# Altium project EL2086.PrjPcb (part 1 of 3)
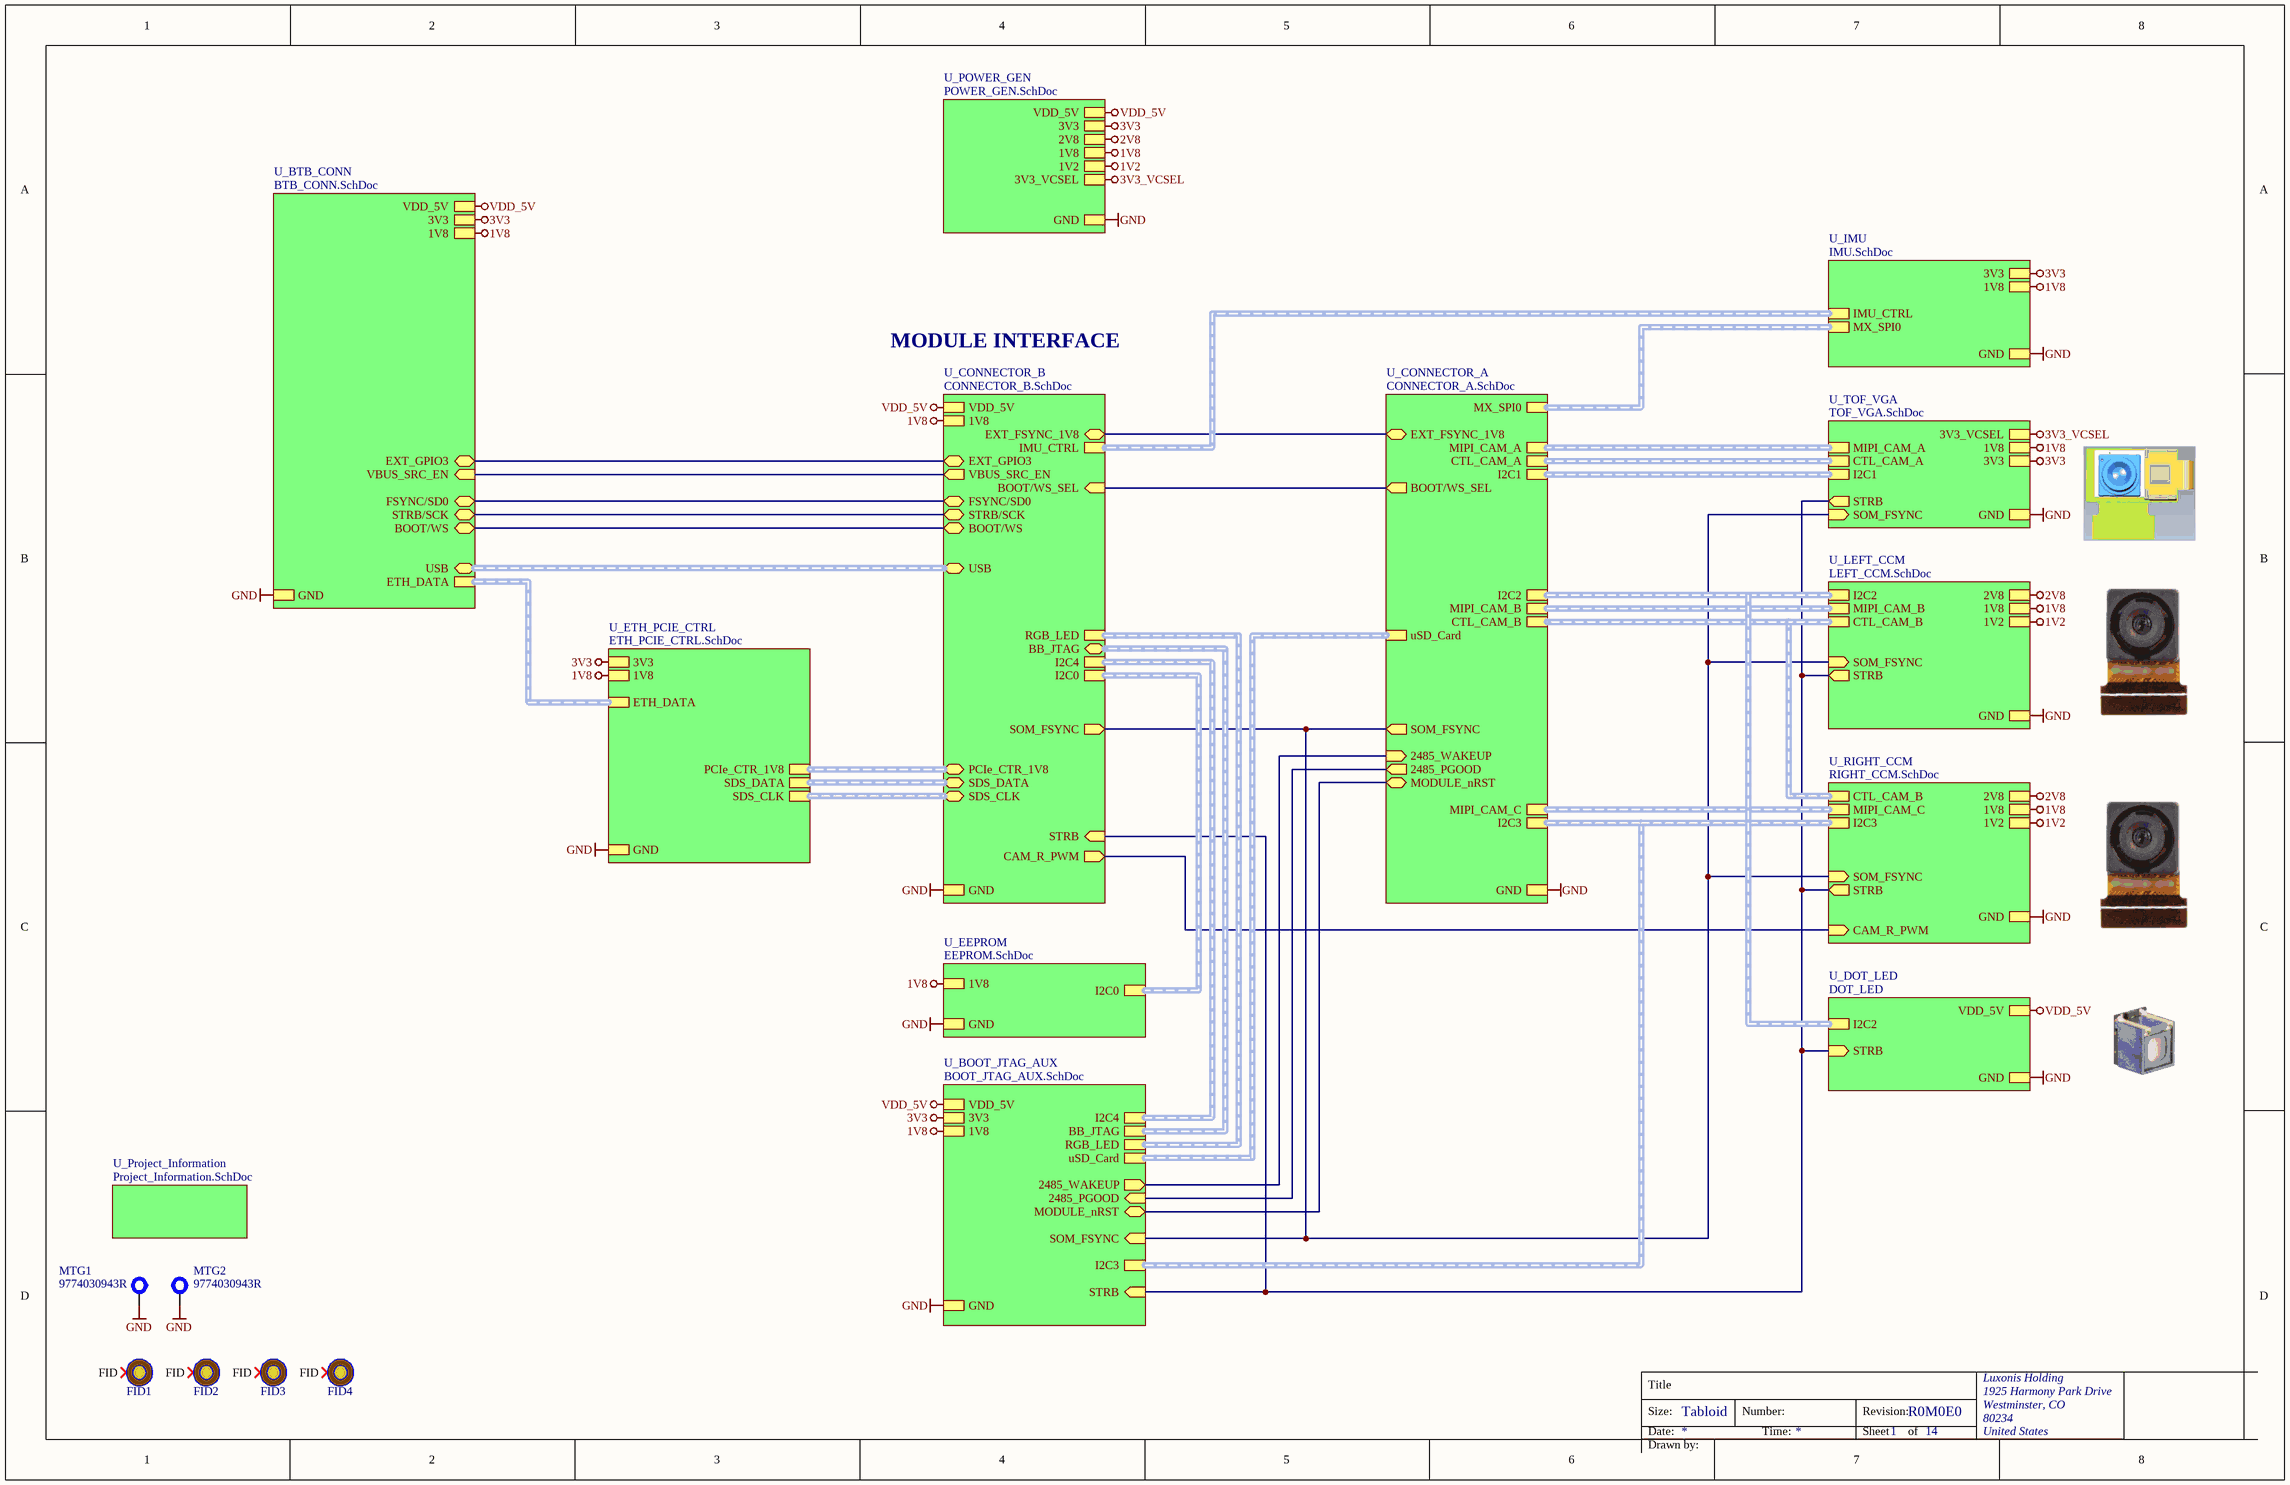
[diagram p0: TopLevel.SchDoc]
document_number: D2088000; drawn_by: Eason Lin; project_title: EL2086; revision: R0M0E0
14 sheets, 259 parts. Net scope: strictly hierarchical (ports join the sheet entries above them; power ports are local).
Board file: EL2086.PcbDoc
Sheets:
  TopLevel.SchDoc
    U_Project_Information = Project_Information.SchDoc
    U_CONNECTOR_B = CONNECTOR_B.SchDoc
    U_CONNECTOR_A = CONNECTOR_A.SchDoc
    U_ETH_PCIE_CTRL = ETH_PCIE_CTRL.SchDoc
    U_BOOT_JTAG_AUX = BOOT_JTAG_AUX.SchDoc
    U_POWER_GEN = POWER_GEN.SchDoc
    U_TOF_VGA = TOF_VGA.SchDoc
    U_RIGHT_CCM = RIGHT_CCM.SchDoc
    U_LEFT_CCM = LEFT_CCM.SchDoc
    U_IMU = IMU.SchDoc
    U_EEPROM = EEPROM.SchDoc
    U_DOT_LED = DOT_LED.SchDoc
    U_BTB_CONN = BTB_CONN.SchDoc

## Sheet TopLevel.SchDoc: =project_title
size Tabloid; CompanyName: Luxonis Holding; DrawnBy: Eason Lin; Organization: Luxonis Holding; Address1: 1925 Harmony Park Drive; Address2: Westminster, CO; Address3: 80234; Address4: United States; DocumentNumber: D2088000; Revision: R0M0E0; SheetNumber: 1; SheetTotal: 14

### Parts
FID1  FIDUCIAL_ROUND_1MM  [FIDUCIAL_ROUND_1MM]  (value not drawn)  (no BOM)
FID2  FIDUCIAL_ROUND_1MM  [FIDUCIAL_ROUND_1MM]  (value not drawn)  (no BOM)
FID3  FIDUCIAL_ROUND_1MM  [FIDUCIAL_ROUND_1MM]  (value not drawn)  (no BOM)
FID4  FIDUCIAL_ROUND_1MM  [FIDUCIAL_ROUND_1MM]  (value not drawn)  (no BOM)
MTG1  9774030943R  [9774030943R]
MTG2  9774030943R  [9774030943R]

### Sub-sheets
U_BOOT_JTAG_AUX = BOOT_JTAG_AUX.SchDoc: RGB_LED (harness RGB_LED), BB_JTAG (harness BB_JTAG), uSD_Card (harness uSD_Card), 2485_WAKEUP (out), I2C3 (harness I2C3), 2485_PGOOD (in), 1V8, 3V3, VDD_5V, STRB (in), SOM_FSYNC (in), I2C4 (harness I2C4), GND, MODULE_nRST (bidir)
U_BTB_CONN = BTB_CONN.SchDoc: VBUS_SRC_EN (in), GND, ETH_DATA (harness ETH_DATA), VDD_5V, 3V3, 1V8, USB (bidir, harness USB), EXT_GPIO3 (bidir), FSYNC/SD0 (bidir), STRB/SCK (bidir), BOOT/WS (bidir)
U_CONNECTOR_A = CONNECTOR_A.SchDoc: uSD_Card (harness uSD_Card), MIPI_CAM_C (harness MIPI_CAM_C), CTL_CAM_A (harness CTL_CAM_A), MIPI_CAM_A (harness MIPI_CAM_A), MIPI_CAM_B (harness MIPI_CAM_B), GND, I2C3 (harness I2C3), CTL_CAM_B (harness CTL_CAM_B), SOM_FSYNC (out), 2485_WAKEUP (in), 2485_PGOOD (out), MX_SPI0 (harness MX_SPI0), I2C1 (harness I2C1), I2C2 (harness I2C2), EXT_FSYNC_1V8 (bidir), MODULE_nRST (bidir), BOOT/WS_SEL (out)
U_CONNECTOR_B = CONNECTOR_B.SchDoc: I2C0 (harness I2C0), VDD_5V, PCIe_CTR_1V8 (bidir, harness PCIe_CTR_1V8), BB_JTAG (bidir, harness BB_JTAG), SDS_DATA (bidir, harness SDS_DATA), SDS_CLK (bidir, harness SDS_CLK), IMU_CTRL (harness IMU_CTRL), RGB_LED (harness RGB_LED), 1V8, CAM_R_PWM (out), SOM_FSYNC (out), I2C4 (harness I2C4), GND, USB (bidir, harness USB), VBUS_SRC_EN (out), EXT_GPIO3 (bidir), BOOT/WS (bidir), STRB/SCK (bidir), FSYNC/SD0 (bidir), BOOT/WS_SEL (in), EXT_FSYNC_1V8 (bidir), STRB (in)
U_DOT_LED = DOT_LED: VDD_5V, GND, I2C2 (harness I2C2), STRB (in)
U_EEPROM = EEPROM.SchDoc: 1V8, I2C0 (harness I2C0), GND
U_ETH_PCIE_CTRL = ETH_PCIE_CTRL.SchDoc: ETH_DATA (harness ETH_DATA), SDS_DATA (harness SDS_DATA), 3V3, SDS_CLK (harness SDS_CLK), 1V8, PCIe_CTR_1V8 (harness PCIe_CTR_1V8), GND
U_IMU = IMU.SchDoc: 3V3, 1V8, MX_SPI0 (harness MX_SPI0), IMU_CTRL (harness IMU_CTRL), GND
U_LEFT_CCM = LEFT_CCM.SchDoc: I2C2 (harness I2C2), CTL_CAM_B (harness CTL_CAM_B), MIPI_CAM_B (harness MIPI_CAM_B), 1V2, 2V8, 1V8, SOM_FSYNC (in), STRB (out), GND
U_POWER_GEN = POWER_GEN.SchDoc: GND, 3V3, 1V8, 1V2, 2V8, VDD_5V, 3V3_VCSEL
U_Project_Information = Project_Information.SchDoc: no entries
U_RIGHT_CCM = RIGHT_CCM.SchDoc: MIPI_CAM_C (harness MIPI_CAM_C), I2C3 (harness I2C3), 1V2, 2V8, 1V8, CTL_CAM_B (harness CTL_CAM_B), CAM_R_PWM (in), SOM_FSYNC (in), GND, STRB (out)
U_TOF_VGA = TOF_VGA.SchDoc: 3V3_VCSEL, 1V8, GND, I2C1 (harness I2C1), CTL_CAM_A (harness CTL_CAM_A), MIPI_CAM_A (harness MIPI_CAM_A), SOM_FSYNC (in), 3V3, STRB (out)

### Nets
1V2: sheet U_POWER_GEN/1V2, sheet U_RIGHT_CCM/1V2, sheet U_LEFT_CCM/1V2
1V8: sheet U_CONNECTOR_B/1V8, sheet U_ETH_PCIE_CTRL/1V8, sheet U_BOOT_JTAG_AUX/1V8, sheet U_POWER_GEN/1V8, sheet U_TOF_VGA/1V8, sheet U_RIGHT_CCM/1V8, sheet U_LEFT_CCM/1V8, sheet U_IMU/1V8, sheet U_EEPROM/1V8, sheet U_BTB_CONN/1V8
2V8: sheet U_POWER_GEN/2V8, sheet U_RIGHT_CCM/2V8, sheet U_LEFT_CCM/2V8
3V3: sheet U_ETH_PCIE_CTRL/3V3, sheet U_BOOT_JTAG_AUX/3V3, sheet U_POWER_GEN/3V3, sheet U_TOF_VGA/3V3, sheet U_IMU/3V3, sheet U_BTB_CONN/3V3
3V3_VCSEL: sheet U_POWER_GEN/3V3_VCSEL, sheet U_TOF_VGA/3V3_VCSEL
GND: MTG1.1 MTG2.1 ; sheet U_CONNECTOR_B/GND, sheet U_CONNECTOR_A/GND, sheet U_ETH_PCIE_CTRL/GND, sheet U_BOOT_JTAG_AUX/GND, sheet U_POWER_GEN/GND, sheet U_TOF_VGA/GND, sheet U_RIGHT_CCM/GND, sheet U_LEFT_CCM/GND, sheet U_IMU/GND, sheet U_EEPROM/GND, sheet U_DOT_LED/GND, sheet U_BTB_CONN/GND
VDD_5V: sheet U_CONNECTOR_B/VDD_5V, sheet U_BOOT_JTAG_AUX/VDD_5V, sheet U_POWER_GEN/VDD_5V, sheet U_DOT_LED/VDD_5V, sheet U_BTB_CONN/VDD_5V
2485_PGOOD: sheet U_CONNECTOR_A/2485_PGOOD, sheet U_BOOT_JTAG_AUX/2485_PGOOD
2485_WAKEUP: sheet U_CONNECTOR_A/2485_WAKEUP, sheet U_BOOT_JTAG_AUX/2485_WAKEUP
BOOT/WS: sheet U_CONNECTOR_B/BOOT/WS, sheet U_BTB_CONN/BOOT/WS
BOOT/WS_SEL: sheet U_CONNECTOR_B/BOOT/WS_SEL, sheet U_CONNECTOR_A/BOOT/WS_SEL
CAM_R_PWM: sheet U_CONNECTOR_B/CAM_R_PWM, sheet U_RIGHT_CCM/CAM_R_PWM
EXT_FSYNC_1V8: sheet U_CONNECTOR_B/EXT_FSYNC_1V8, sheet U_CONNECTOR_A/EXT_FSYNC_1V8
FSYNC/SD0: sheet U_CONNECTOR_B/FSYNC/SD0, sheet U_BTB_CONN/FSYNC/SD0
IO50/I2S2_IN_SD0: sheet U_CONNECTOR_B/EXT_GPIO3, sheet U_BTB_CONN/EXT_GPIO3
MODULE_nRST: sheet U_CONNECTOR_A/MODULE_nRST, sheet U_BOOT_JTAG_AUX/MODULE_nRST
SOM_FSYNC: sheet U_CONNECTOR_B/SOM_FSYNC, sheet U_CONNECTOR_A/SOM_FSYNC, sheet U_BOOT_JTAG_AUX/SOM_FSYNC, sheet U_TOF_VGA/SOM_FSYNC, sheet U_RIGHT_CCM/SOM_FSYNC, sheet U_LEFT_CCM/SOM_FSYNC
STRB: sheet U_CONNECTOR_B/STRB, sheet U_BOOT_JTAG_AUX/STRB, sheet U_TOF_VGA/STRB, sheet U_RIGHT_CCM/STRB, sheet U_LEFT_CCM/STRB, sheet U_DOT_LED/STRB
STRB/SCK: sheet U_CONNECTOR_B/STRB/SCK, sheet U_BTB_CONN/STRB/SCK
NetJ7_28: sheet U_CONNECTOR_B/VBUS_SRC_EN, sheet U_BTB_CONN/VBUS_SRC_EN

Not connected (* = marked no-connect by the designer): FID1 FID*; FID2 FID*; FID3 FID*; FID4 FID*

### Buses and harness runs
harness sheet U_BOOT_JTAG_AUX/BB_JTAG = sheet U_CONNECTOR_B/BB_JTAG
harness sheet U_BOOT_JTAG_AUX/I2C3 = sheet U_CONNECTOR_A/I2C3 = sheet U_RIGHT_CCM/I2C3
harness sheet U_BOOT_JTAG_AUX/I2C4 = sheet U_CONNECTOR_B/I2C4
harness sheet U_BOOT_JTAG_AUX/RGB_LED = sheet U_CONNECTOR_B/RGB_LED
harness sheet U_BOOT_JTAG_AUX/uSD_Card = sheet U_CONNECTOR_A/uSD_Card
harness sheet U_BTB_CONN/ETH_DATA = sheet U_ETH_PCIE_CTRL/ETH_DATA
harness sheet U_BTB_CONN/USB = sheet U_CONNECTOR_B/USB
harness sheet U_CONNECTOR_A/CTL_CAM_A = sheet U_TOF_VGA/CTL_CAM_A
harness sheet U_CONNECTOR_A/CTL_CAM_B = sheet U_LEFT_CCM/CTL_CAM_B = sheet U_RIGHT_CCM/CTL_CAM_B
harness sheet U_CONNECTOR_A/I2C1 = sheet U_TOF_VGA/I2C1
harness sheet U_CONNECTOR_A/I2C2 = sheet U_DOT_LED/I2C2 = sheet U_LEFT_CCM/I2C2
harness sheet U_CONNECTOR_A/MIPI_CAM_A = sheet U_TOF_VGA/MIPI_CAM_A
harness sheet U_CONNECTOR_A/MIPI_CAM_B = sheet U_LEFT_CCM/MIPI_CAM_B
harness sheet U_CONNECTOR_A/MIPI_CAM_C = sheet U_RIGHT_CCM/MIPI_CAM_C
harness sheet U_CONNECTOR_A/MX_SPI0 = sheet U_IMU/MX_SPI0
harness sheet U_CONNECTOR_B/I2C0 = sheet U_EEPROM/I2C0
harness sheet U_CONNECTOR_B/IMU_CTRL = sheet U_IMU/IMU_CTRL
harness sheet U_CONNECTOR_B/PCIe_CTR_1V8 = sheet U_ETH_PCIE_CTRL/PCIe_CTR_1V8
harness sheet U_CONNECTOR_B/SDS_CLK = sheet U_ETH_PCIE_CTRL/SDS_CLK
harness sheet U_CONNECTOR_B/SDS_DATA = sheet U_ETH_PCIE_CTRL/SDS_DATA

### Notes on the sheet
- MODULE INTERFACE
- Title
- Size:
- Date:
- Tabloid
- Number:
- Time:
- Revision:
- Sheet
- of
- Drawn by:

### Library data of the parts
FID1-FID4 = FIDUCIAL: Fiducial with various available footprints
MTG1 MTG2 = CMP-090-000000-4: Spacers/Standoffs; Manufacturer 1: Wurth Electronics; Manufacturer Part Number 1: 9774030943R

## Sheet Project_Information.SchDoc: =project_title
size Tabloid; CompanyName: Luxonis Holding; DrawnBy: Eason Lin; Organization: Luxonis Holding; Address1: 1925 Harmony Park Drive; Address2: Westminster, CO; Address3: 80234; Address4: United States; DocumentNumber: D2088000; Revision: R0M0E0; SheetNumber: 2; SheetTotal: 14
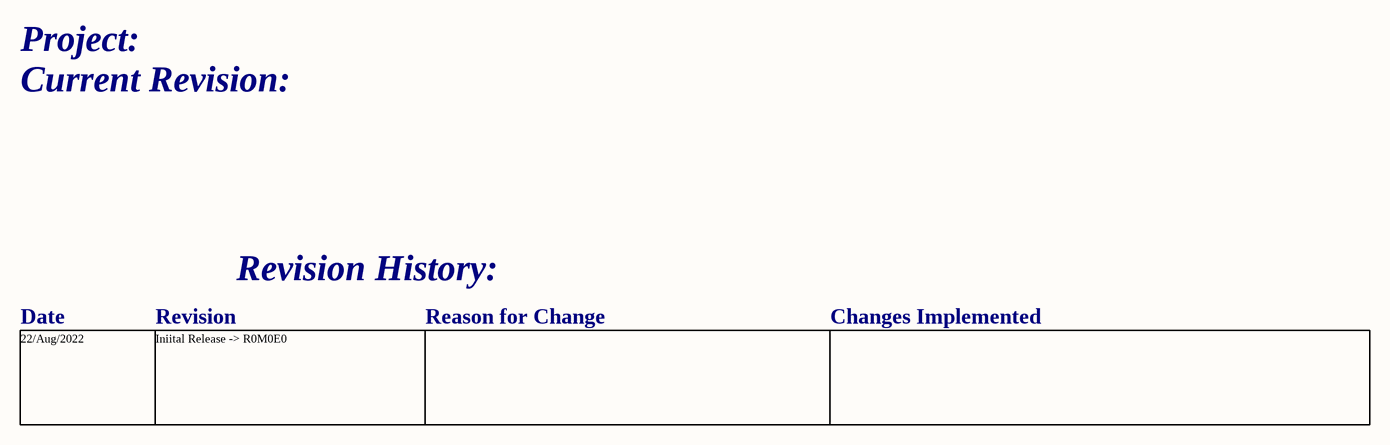
[diagram p1: Project_Information.SchDoc]

### Notes on the sheet
- Project:
- Current Revision:
- Revision History:
- Date
- Revision
- Reason for Change
- Changes Implemented
- 22/Aug/2022
- Iniital Release -> R0M0E0
- Title
- Size:
- Date:
- Tabloid
- Number:
- Time:
- Revision:
- Sheet
- of
- Drawn by:

## Sheet CONNECTOR_B.SchDoc: =project_title
size Tabloid; CompanyName: Luxonis Holding; DrawnBy: Eason Lin; Organization: Luxonis Holding; Address1: 1925 Harmony Park Drive; Address2: Westminster, CO; Address3: 80234; Address4: United States; DocumentNumber: D2088000; Revision: R0M0E0; SheetNumber: 6; SheetTotal: 14
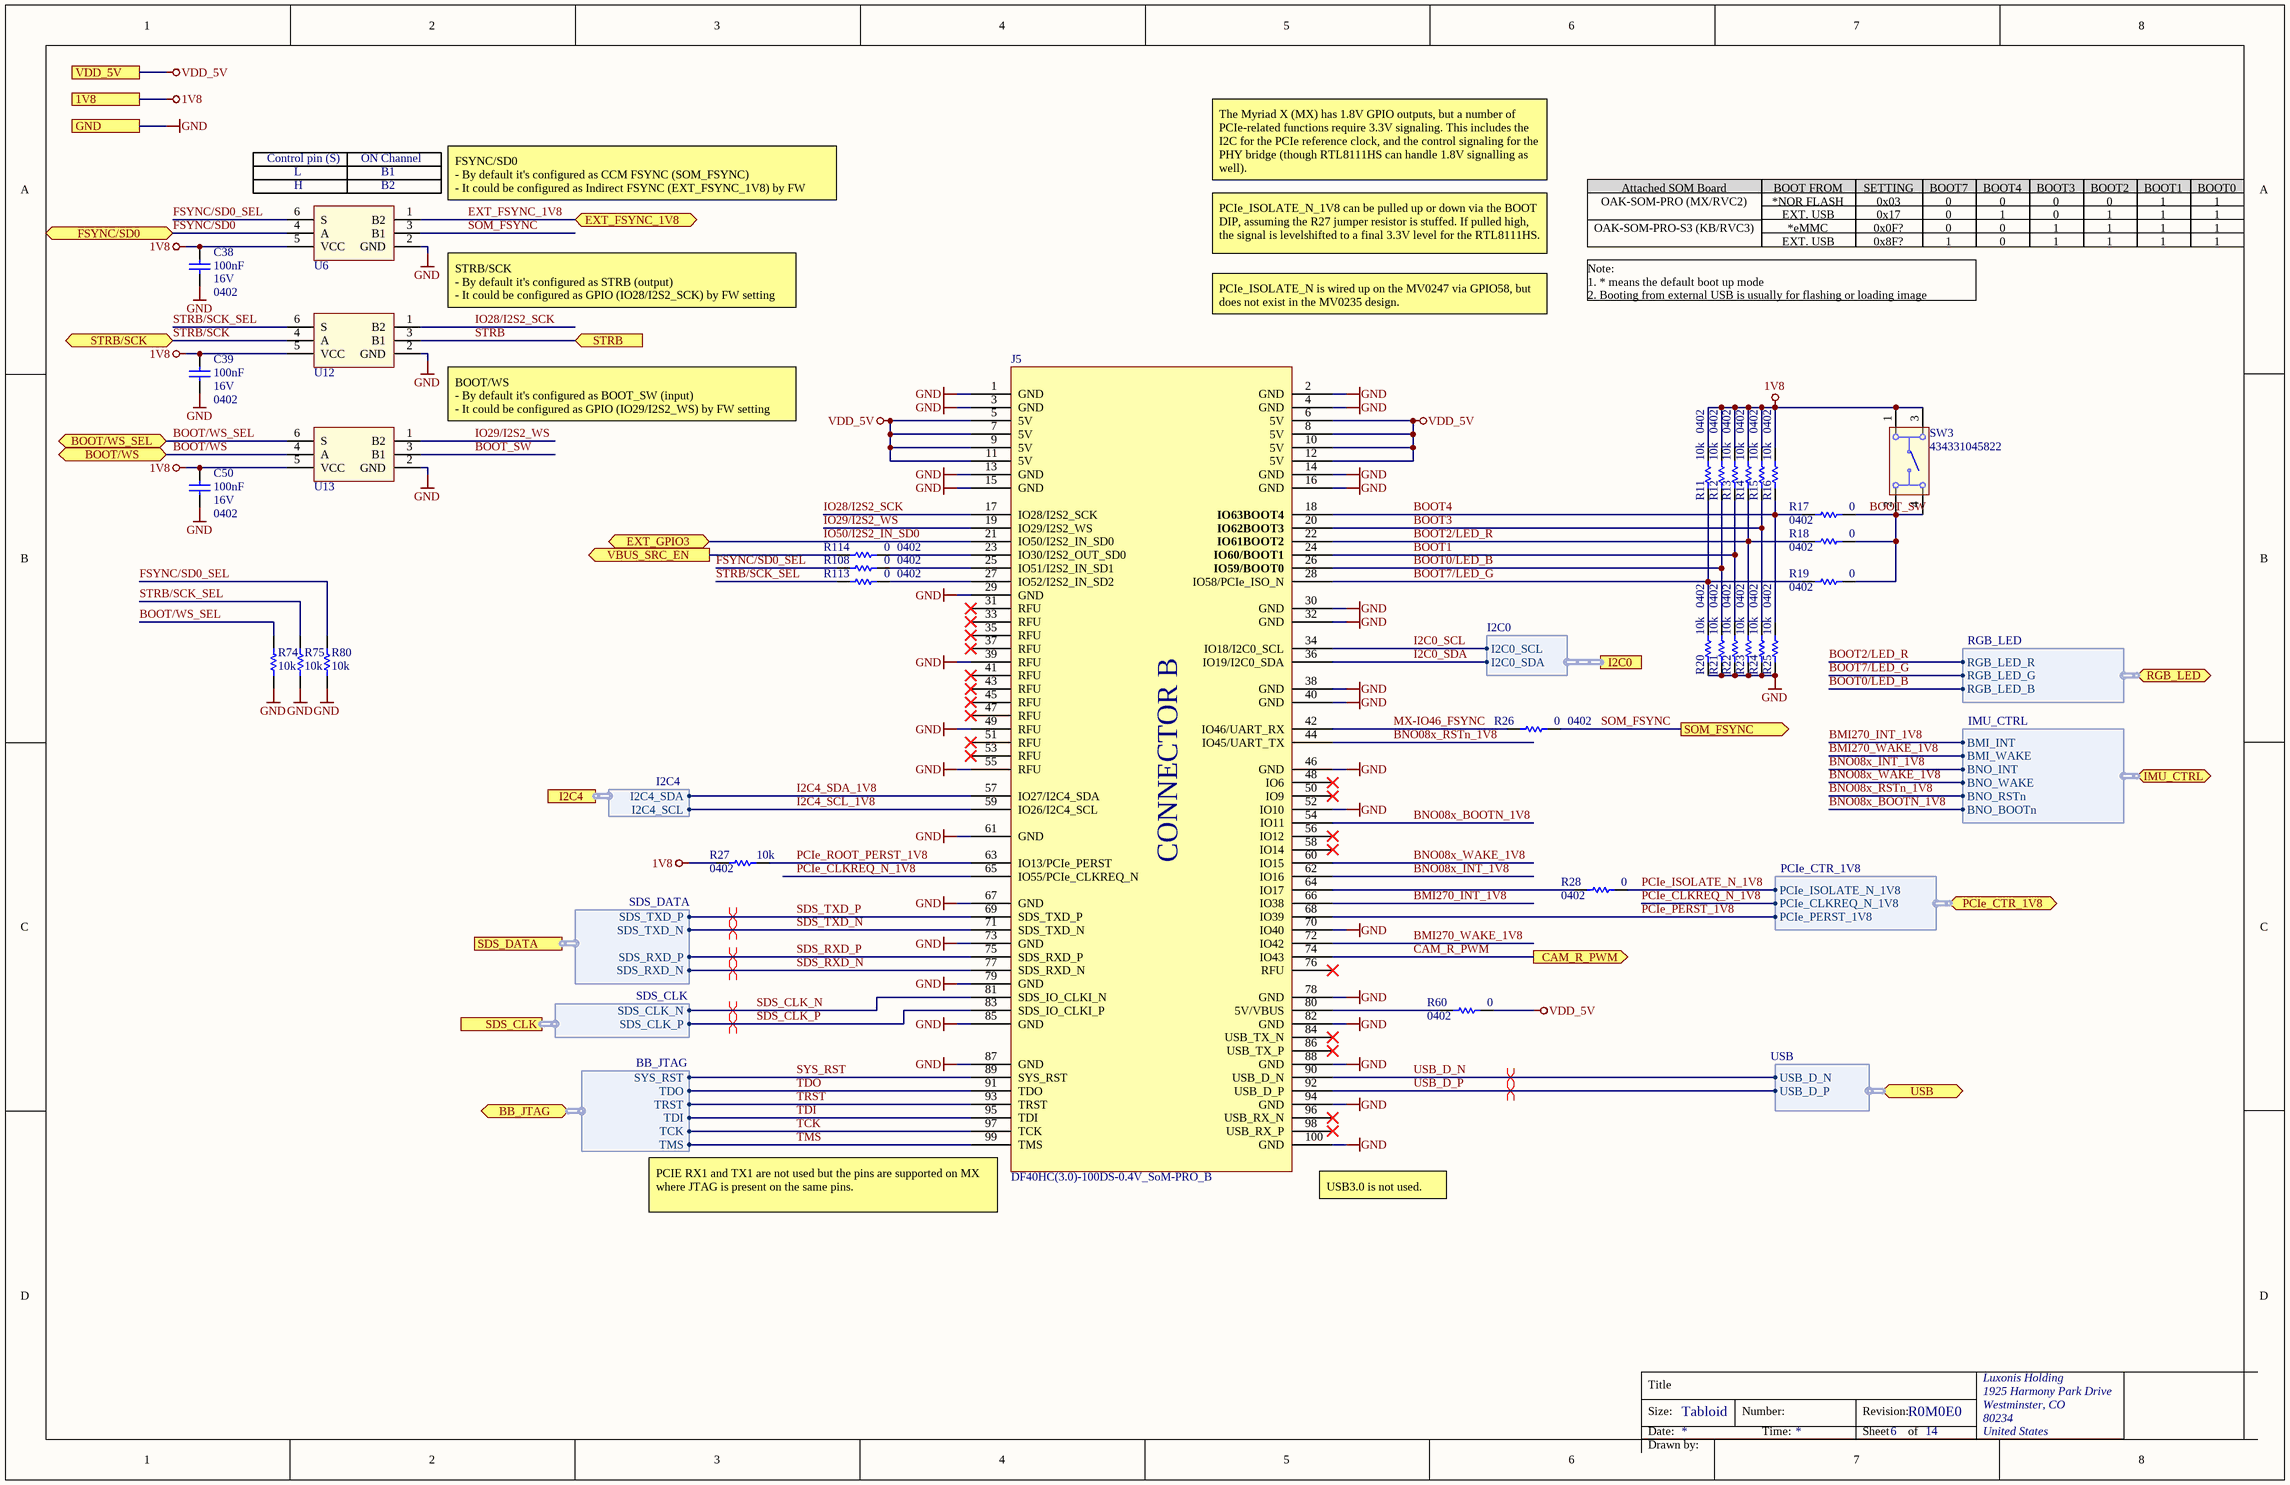
[diagram p2: CONNECTOR_B.SchDoc]

### Parts
C38  value 100nF  Voltage Rating: 16V  Case/Package: 0402  [CAPC0402(1005)60_N]  (hidden comment: CL05B104KO5NFNC)
C39  value 100nF  Voltage Rating: 16V  Case/Package: 0402  [CAPC0402(1005)60_N]  (hidden comment: CL05B104KO5NFNC)
C50  value 100nF  Voltage Rating: 16V  Case/Package: 0402  [CAPC0402(1005)60_N]  (hidden comment: CL05B104KO5NFNC)
J5  DF40HC(3.0)-100DS-0.4V_SoM-PRO_B  [CON_B_BW2099_SoM_DF40HC-3.0-100DS-0.4V_minpad]
R11  value 10k  Case/Package: 0402  [RESC0402(1005)_N]  (hidden comment: RC0402FR-1310KL)
R12  value 10k  Case/Package: 0402  [RESC0402(1005)_N]  (hidden comment: RC0402FR-1310KL)
R13  value 10k  Case/Package: 0402  [RESC0402(1005)_N]  (hidden comment: RC0402FR-1310KL)
R14  value 10k  Case/Package: 0402  [RESC0402(1005)_N]  (hidden comment: RC0402FR-1310KL)
R15  value 10k  Case/Package: 0402  [RESC0402(1005)_N]  (hidden comment: RC0402FR-1310KL)
R16  value 10k  Case/Package: 0402  [RESC0402(1005)_N]  (hidden comment: RC0402FR-1310KL)
R17  value 0  Case/Package: 0402  [RESC0402(1005)_L]  (hidden comment: CRCW04020000Z0ED)
R18  value 0  Case/Package: 0402  [RESC0402(1005)_L]  (hidden comment: CRCW04020000Z0ED)
R19  value 0  Case/Package: 0402  [RESC0402(1005)_L]  (hidden comment: CRCW04020000Z0ED)
R20  value 10k  Case/Package: 0402  [RESC0402(1005)_N]  (hidden comment: RC0402FR-1310KL)
R21  value 10k  Case/Package: 0402  [RESC0402(1005)_N]  (hidden comment: RC0402FR-1310KL)
R22  value 10k  Case/Package: 0402  [RESC0402(1005)_N]  (hidden comment: RC0402FR-1310KL)
R23  value 10k  Case/Package: 0402  [RESC0402(1005)_N]  (hidden comment: RC0402FR-1310KL)
R24  value 10k  Case/Package: 0402  [RESC0402(1005)_N]  (hidden comment: RC0402FR-1310KL)
R25  value 10k  Case/Package: 0402  [RESC0402(1005)_N]  (hidden comment: RC0402FR-1310KL)
R26  value 0  Case/Package: 0402  [RESC0402(1005)_L]  (hidden comment: CRCW04020000Z0ED)
R27  value 10k  Case/Package: 0402  [RESC0402(1005)_N]  (hidden comment: RC0402FR-1310KL)
R28  value 0  Case/Package: 0402  [RESC0402(1005)_L]  (hidden comment: CRCW04020000Z0ED)
R60  value 0  Case/Package: 0402  [RESC0402(1005)_L]  (hidden comment: CRCW04020000Z0ED)
R74  value 10k  [RESC0402(1005)_N]  (hidden comment: RC0402FR-1310KL)
R75  value 10k  [RESC0402(1005)_N]  (hidden comment: RC0402FR-1310KL)
R80  value 10k  [RESC0402(1005)_N]  (hidden comment: RC0402FR-1310KL)
R108  value 0  Case/Package: 0402  [RESC0402(1005)_L]  (hidden comment: CRCW04020000Z0ED)
R113  value 0  Case/Package: 0402  [RESC0402(1005)_L]  (hidden comment: CRCW04020000Z0ED)
R114  value 0  Case/Package: 0402  [RESC0402(1005)_L]  (hidden comment: CRCW04020000Z0ED)
SW3  434331045822  [434331045822]
U6  SN74LVC1G3157DCKR  [DCK6_65]  (value not drawn)
U12  SN74LVC1G3157DCKR  [DCK6_65]  (value not drawn)
U13  SN74LVC1G3157DCKR  [DCK6_65]  (value not drawn)

### Ports
1V8, BB_JTAG (bidir, harness BB_JTAG), BOOT/WS (bidir), BOOT/WS_SEL (bidir), CAM_R_PWM (out), EXT_FSYNC_1V8 (bidir), EXT_GPIO3 (bidir), FSYNC/SD0 (bidir), GND, I2C0 (harness I2C0), I2C4 (harness I2C4), IMU_CTRL (bidir, harness IMU_CTRL), PCIe_CTR_1V8 (bidir, harness PCIe_CTR_1V8), RGB_LED (bidir, harness RGB_LED), SDS_CLK (harness SDS_CLK), SDS_DATA (harness SDS_DATA), SOM_FSYNC (out), STRB (in), STRB/SCK (bidir), USB (bidir, harness USB), VBUS_SRC_EN (out), VDD_5V

### Harnesses
USB: USB_D_P, USB_D_N
I2C0: I2C0_SDA, I2C0_SCL
BB_JTAG: SYS_RST, TDO, TRST, TDI, TCK, TMS
SDS_DATA: SDS_TXD_P, SDS_TXD_N, SDS_RXD_P, SDS_RXD_N
PCIe_CTR_1V8: PCIe_CLKREQ_N_1V8, PCIe_ISOLATE_N_1V8, PCIe_PERST_1V8
SDS_CLK: SDS_CLK_P, SDS_CLK_N
RGB_LED: RGB_LED_G, RGB_LED_B, RGB_LED_R
IMU_CTRL: BMI_INT, BMI_WAKE, BNO_INT, BNO_WAKE, BNO_RSTn, BNO_BOOTn
I2C4: I2C4_SDA, I2C4_SCL

### Nets
1V8: C38.2 C39.2 C50.2 R11.2 R12.2 R13.2 R14.2 R15.2 R16.2 R27.2 SW3.1 SW3.3 U6.5(VCC) U12.5(VCC) U13.5(VCC) ; port 1V8
GND: C38.1 C39.1 C50.1 J5.1(GND) J5.2(GND) J5.3(GND) J5.4(GND) J5.13(GND) J5.14(GND) J5.15(GND) J5.16(GND) J5.29(GND) J5.30(GND) J5.32(GND) J5.38(GND) J5.39(RFU) J5.40(GND) J5.46(GND) J5.49(RFU) J5.52(IO10) J5.55(RFU) J5.61(GND) J5.67(GND) J5.70(IO40) J5.73(GND) J5.78(GND) J5.79(GND) J5.82(GND) J5.85(GND) J5.87(GND) J5.88(GND) J5.94(GND) J5.100(GND) R20.1 R21.1 R22.1 R23.1 R24.1 R25.1 R74.1 R75.1 R80.1 U6.2(GND) U12.2(GND) U13.2(GND) ; port GND
VDD_5V: J5.5(5V) J5.6(5V) J5.7(5V) J5.8(5V) J5.9(5V) J5.10(5V) J5.11(5V) J5.12(5V) R60.2 ; port VDD_5V
BMI270_INT_1V8: J5.66(IO38) ; port IMU_CTRL.BMI_INT
BMI270_WAKE_1V8: J5.72(IO42) ; port IMU_CTRL.BMI_WAKE
BNO08x_BOOTN_1V8: J5.54(IO11) ; port IMU_CTRL.BNO_BOOTn
BNO08x_INT_1V8: J5.62(IO16) ; port IMU_CTRL.BNO_INT
BNO08x_RSTn_1V8: J5.44(IO45/UART_TX) ; port IMU_CTRL.BNO_RSTn
BNO08x_WAKE_1V8: J5.60(IO15) ; port IMU_CTRL.BNO_WAKE
BOOT0/LED_B: J5.26(IO59/BOOT0) R12.1 R21.2 ; port RGB_LED.RGB_LED_B
BOOT1: J5.24(IO60/BOOT1) R13.1 R22.2
BOOT2/LED_R: J5.22(IO61BOOT2) R14.1 R18.1 R23.2 ; port RGB_LED.RGB_LED_R
BOOT3: J5.20(IO62BOOT3) R15.1 R24.2
BOOT4: J5.18(IO63BOOT4) R16.1 R17.1 R25.2
BOOT7/LED_G: J5.28(IO58/PCIe_ISO_N) R11.1 R19.1 R20.2 ; port RGB_LED.RGB_LED_G
BOOT/WS: U13.4(A) ; port BOOT/WS
BOOT/WS_SEL: R74.2 U13.6(S) ; port BOOT/WS_SEL
BOOT_SW: R17.2 R18.2 R19.2 SW3.2 SW3.4 U13.3(B1)
CAM_R_PWM: J5.74(IO43) ; port CAM_R_PWM
EXT_FSYNC_1V8: U6.1(B2) ; port EXT_FSYNC_1V8
FSYNC/SD0: U6.4(A) ; port FSYNC/SD0
FSYNC/SD0_SEL: R80.2 R108.1 U6.6(S)
I2C0_SCL: J5.34(IO18/I2C0_SCL) ; port I2C0.I2C0_SCL
I2C0_SDA: J5.36(IO19/I2C0_SDA) ; port I2C0.I2C0_SDA
I2C4_SCL_1V8: J5.59(IO26/I2C4_SCL) ; port I2C4.I2C4_SCL
I2C4_SDA_1V8: J5.57(IO27/I2C4_SDA) ; port I2C4.I2C4_SDA
IO28/I2S2_SCK: J5.17(IO28/I2S2_SCK) U12.1(B2)
IO29/I2S2_WS: J5.19(IO29/I2S2_WS) U13.1(B2)
IO50/I2S2_IN_SD0: J5.21(IO50/I2S2_IN_SD0) ; port EXT_GPIO3
MX-IO46_FSYNC: J5.42(IO46/UART_RX) R26.1
PCIe_CLKREQ_N_1V8: J5.65(IO55/PCIe_CLKREQ_N) ; port PCIe_CTR_1V8.PCIe_CLKREQ_N_1V8
PCIe_ISOLATE_N_1V8: R28.2 ; port PCIe_CTR_1V8.PCIe_ISOLATE_N_1V8
PCIe_PERST_1V8: J5.68(IO39) ; port PCIe_CTR_1V8.PCIe_PERST_1V8
PCIe_ROOT_PERST_1V8: J5.63(IO13/PCIe_PERST) R27.1
SDS_CLK_N: J5.81(SDS_IO_CLKI_N) ; port SDS_CLK.SDS_CLK_N
SDS_CLK_P: J5.83(SDS_IO_CLKI_P) ; port SDS_CLK.SDS_CLK_P
SDS_RXD_N: J5.77(SDS_RXD_N) ; port SDS_DATA.SDS_RXD_N
SDS_RXD_P: J5.75(SDS_RXD_P) ; port SDS_DATA.SDS_RXD_P
SDS_TXD_N: J5.71(SDS_TXD_N) ; port SDS_DATA.SDS_TXD_N
SDS_TXD_P: J5.69(SDS_TXD_P) ; port SDS_DATA.SDS_TXD_P
SOM_FSYNC: R26.2 U6.3(B1) ; port SOM_FSYNC
STRB: U12.3(B1) ; port STRB
STRB/SCK: U12.4(A) ; port STRB/SCK
STRB/SCK_SEL: R75.2 R113.1 U12.6(S)
SYS_RST: J5.89(SYS_RST) ; port BB_JTAG.SYS_RST
TCK: J5.97(TCK) ; port BB_JTAG.TCK
TDI: J5.95(TDI) ; port BB_JTAG.TDI
TDO: J5.91(TDO) ; port BB_JTAG.TDO
TMS: J5.99(TMS) ; port BB_JTAG.TMS
TRST: J5.93(TRST) ; port BB_JTAG.TRST
USB_D_N: J5.90(USB_D_N) ; port USB.USB_D_N
USB_D_P: J5.92(USB_D_P) ; port USB.USB_D_P
NetJ5_23: J5.23(IO30/I2S2_OUT_SD0) R114.2
NetJ5_25: J5.25(IO51/I2S2_IN_SD1) R108.2
NetJ5_27: J5.27(IO52/I2S2_IN_SD2) R113.2
NetJ5_64: J5.64(IO17) R28.1
NetJ5_80: J5.80(5V/VBUS) R60.1
NetJ7_28: R114.1 ; port VBUS_SRC_EN

Not connected (* = marked no-connect by the designer): J5 31(RFU)* 33(RFU)* 35(RFU)* 37(RFU)* 41(RFU)* 43(RFU)* 45(RFU)* 47(RFU)* 48(IO6)* 50(IO9)* 51(RFU)* 53(RFU)* 56(IO12)* 58(IO14)* 76(RFU)* 84(USB_TX_N)* 86(USB_TX_P)* 96(USB_RX_N)* 98(USB_RX_P)*

### Layout directives
differential pair; net class USB2; differential pair class 85ohm: USB_D_N, USB_D_P
differential pair; net class PCIE; differential pair class 100ohm: SDS_CLK_N, SDS_CLK_P, SDS_RXD_N, SDS_RXD_P, SDS_TXD_N, SDS_TXD_P

### Notes on the sheet
- Control pin (S)
- ON Channel
- (near U6) L
- (near U6) H
- (near U6) B1
- (near U6) B2
- FSYNC/SD0
  - By default it's configured as CCM FSYNC (SOM_FSYNC)
  - It could be configured as Indirect FSYNC (EXT_FSYNC_1V8) by FW setting
- The Myriad X (MX) has 1.8V GPIO outputs, but a number of PCIe-related functions require 3.3V signaling. This includes the I2C for the PCIe reference clock, and the control signaling for the PHY bridge (though RTL8111HS can handle 1.8V signalling as well).
- Attached SOM Board
- OAK-SOM-PRO (MX/RVC2)
- BOOT FROM
- *NOR FLASH
- EXT. USB
- *eMMC
- SETTING
- 0x03
- 0x17
- 0x0F?
- BOOT7
- 0
- BOOT4
- 1
- BOOT3
- BOOT2
- BOOT1
- BOOT0
- STRB/SCK
  - By default it's configured as STRB (output)
  - It could be configured as GPIO (IO28/I2S2_SCK) by FW setting
- PCIe_ISOLATE_N_1V8 can be pulled up or down via the BOOT DIP, assuming the R27 jumper resistor is stuffed. If pulled high, the signal is levelshifted to a final 3.3V level for the RTL8111HS.
- OAK-SOM-PRO-S3 (KB/RVC3)
- Note:
  1. * means the default boot up mode
  2. Booting from external USB is usually for flashing or loading image
- 0x8F?
- PCIe_ISOLATE_N is wired up on the MV0247 via GPIO58, but does not exist in the MV0235 design.
- BOOT/WS
  - By default it's configured as BOOT_SW (input)
  - It could be configured as GPIO (IO29/I2S2_WS) by FW setting
- (near J5) PCIE RX1 and TX1 are not used but the pins are supported on MX where JTAG is present on the same pins.
- (near J5) USB3.0 is not used.
- Title
- Size:
- Date:
- Tabloid
- Number:
- Time:
- Revision:
- Sheet
- of
- Drawn by:
- (in symbol CMP-005-000053-5) CONNECTOR B

### Library data of the parts
C38 C39 C50 = CMP-108-000002-6: CAP CER 0.1UF 16V X7R 0402 10%; Manufacturer 1: Samsung; ComponentLink1URL: https://datasheet.ciiva.com/25767/cl05b104ko5nfnc-25767124.pdf?src-supplier=Digi-Key; Length: 1mm; Design Item ID: CL05B104KO5NFNC; Tolerance: 10%; Min Operating Temperature: -55°C; Width: 0.02inch; Dielectric: X7R; ComponentLink1Description: https://datasheet.ciiva.com/25767/cl05b104ko5nfnc-25767124.pdf?src-supplier=Digi-Key; Height: 0.5mm; Depth: 0.5mm; Manufacturer Part Number 1: CL05B104KO5NFNC; Max Operating Temperature: 125°C; Mounting Technology: SMT
J5 = CMP-005-000053-5: OAK-SoM-Pro base board conn. B; Manufacturer Part Number 1: DF40HC(3.0)-100DS-0.4V(58); Manufacturer 1: Hirose; Connector Type: Receptacle; Pitch: 0.016inch; Number of Positions: 100; System: Connector; Design Item ID: DF40HC(3.0)-100DS-0.4V_SoM-PRO_B; Stock 1: 2172; Stock 2: 2078; Contact Plating: Gold; Lead Free: Lead Free; Pricing 2: 1=2.50000, 10=2.40000, 25=2.10000, 50=2.10000, 100=2.00000, 250=1.76000, 500=1.71000, 1000=1.45000, 2000=1.36000, 5000=1.31000, 10000=1.31000 (USD); ComponentLink4Description: https://datasheet.ciiva.com/18562/ed-df40-20140305-18562462.pdf?src-supplier=Digi-Key; Mount: Surface Mount; Number of Rows: 2; ComponentLink1URL: https://datasheet.ciiva.com/46636/ed-df40-20140305-46636517.pdf?src-supplier=Digi-Key; ComponentLink2URL: https://datasheet.ciiva.com/18562/ed-df40-20140305-18562189.pdf?src-supplier=Digi-Key; ComponentLink4URL: https://datasheet.ciiva.com/18562/ed-df40-20140305-18562462.pdf?src-supplier=Digi-Key; Source: LuxonisMaster.SchLib; Pricing 1: 1=2.54000, 10=2.26000, 25=2.07000, 50=2.07000, 100=1.98000, 250=1.79000, 500=1.65000, 1000=1.41000, 3000=1.32000, 6000=1.23000, 10000=1.23000 (USD); ComponentLink2Description: https://datasheet.ciiva.com/18562/ed-df40-20140305-18562189.pdf?src-supplier=Digi-Key; RoHS: Yes; ComponentLink3URL: https://datasheet.ciiva.com/13559/ed-df40-20140305-13559540.pdf?src-supplier=Mouser; Package Quantity: 1000; Packaging: Tape and Reel; ComponentLink1Description: https://datasheet.ciiva.com/46636/ed-df40-20140305-46636517.pdf?src-supplier=Digi-Key; ComponentLink3Description: https://datasheet.ciiva.com/13559/ed-df40-20140305-13559540.pdf?src-supplier=Mouser; Pins: 100
R11-R16 R20-R25 R27 R74 R75 R80 = CMP-115-000004-8: RES SMD 10K OHM 1% 1/16W 0402; Manufacturer 1: Yageo; Power Rating: 62.5mW; Temperature Coefficient: 100ppm/°C; Voltage Rating: 50V; Min Operating Temperature: -55°C; Max Operating Temperature: 155°C; Design Item ID: RC0402FR-1310KL; Tolerance: 1%; Manufacturer Part Number 1: RC0402FR-1310KL
  R74 R75 R80: Case/Package: 0402
R17-R19 R26 R28 R60 R108 R113 R114 = CMP-013-000022-11: RES SMD 0 OHM 5% 1/16W 0402; Manufacturer 1: Vishay; Voltage Rating: 50V; Power Rating: 63mW; Max Operating Temperature: 155°C; Manufacturer Part Number 1: CRCW04020000Z0ED; Tolerance: 5%; Min Operating Temperature: -55°C; Design Item ID: CRCW04020000Z0ED
SW3 = CMP-011-00016-3: Keypad Switch, 1 Switches, SPST, Momentary-tactile, 0.05A, 12VDC, 2.65N, Solder Terminal, Surface Mount-right Angle; Manufacturer 1: Wurth Electronics; Voltage Rating: 12V; Max Current Rating: 50mA; Throw Configuration: SPST-NO; Supplier Part Number 1: 732-7055-2-ND; Manufacturer part number 1: 434331045822; Pins: 4; Supplier 1: Digi-Key; Current Rating: 50mA; Mounting Technology: SMD; Case/Package: 434331045822
U6 U12 U13 = CMP-010-000023-2: IC SWITCH SPDT SC70-6 1 Circuit IC Switch 2:1 15Ohm SC-70-6; Manufacturer 1: Texas Instruments; Max Operating Temperature: 125°C; Manufacturer Part Number 1: SN74LVC1G3157DCKR; Min Operating Temperature: -40°C; Case/Package: SC

## Sheet CONNECTOR_A.SchDoc: =project_title
size Tabloid; CompanyName: Luxonis Holding; DrawnBy: Eason Lin; Organization: Luxonis Holding; Address1: 1925 Harmony Park Drive; Address2: Westminster, CO; Address3: 80234; Address4: United States; DocumentNumber: D2088000; Revision: R0M0E0; SheetNumber: 5; SheetTotal: 14
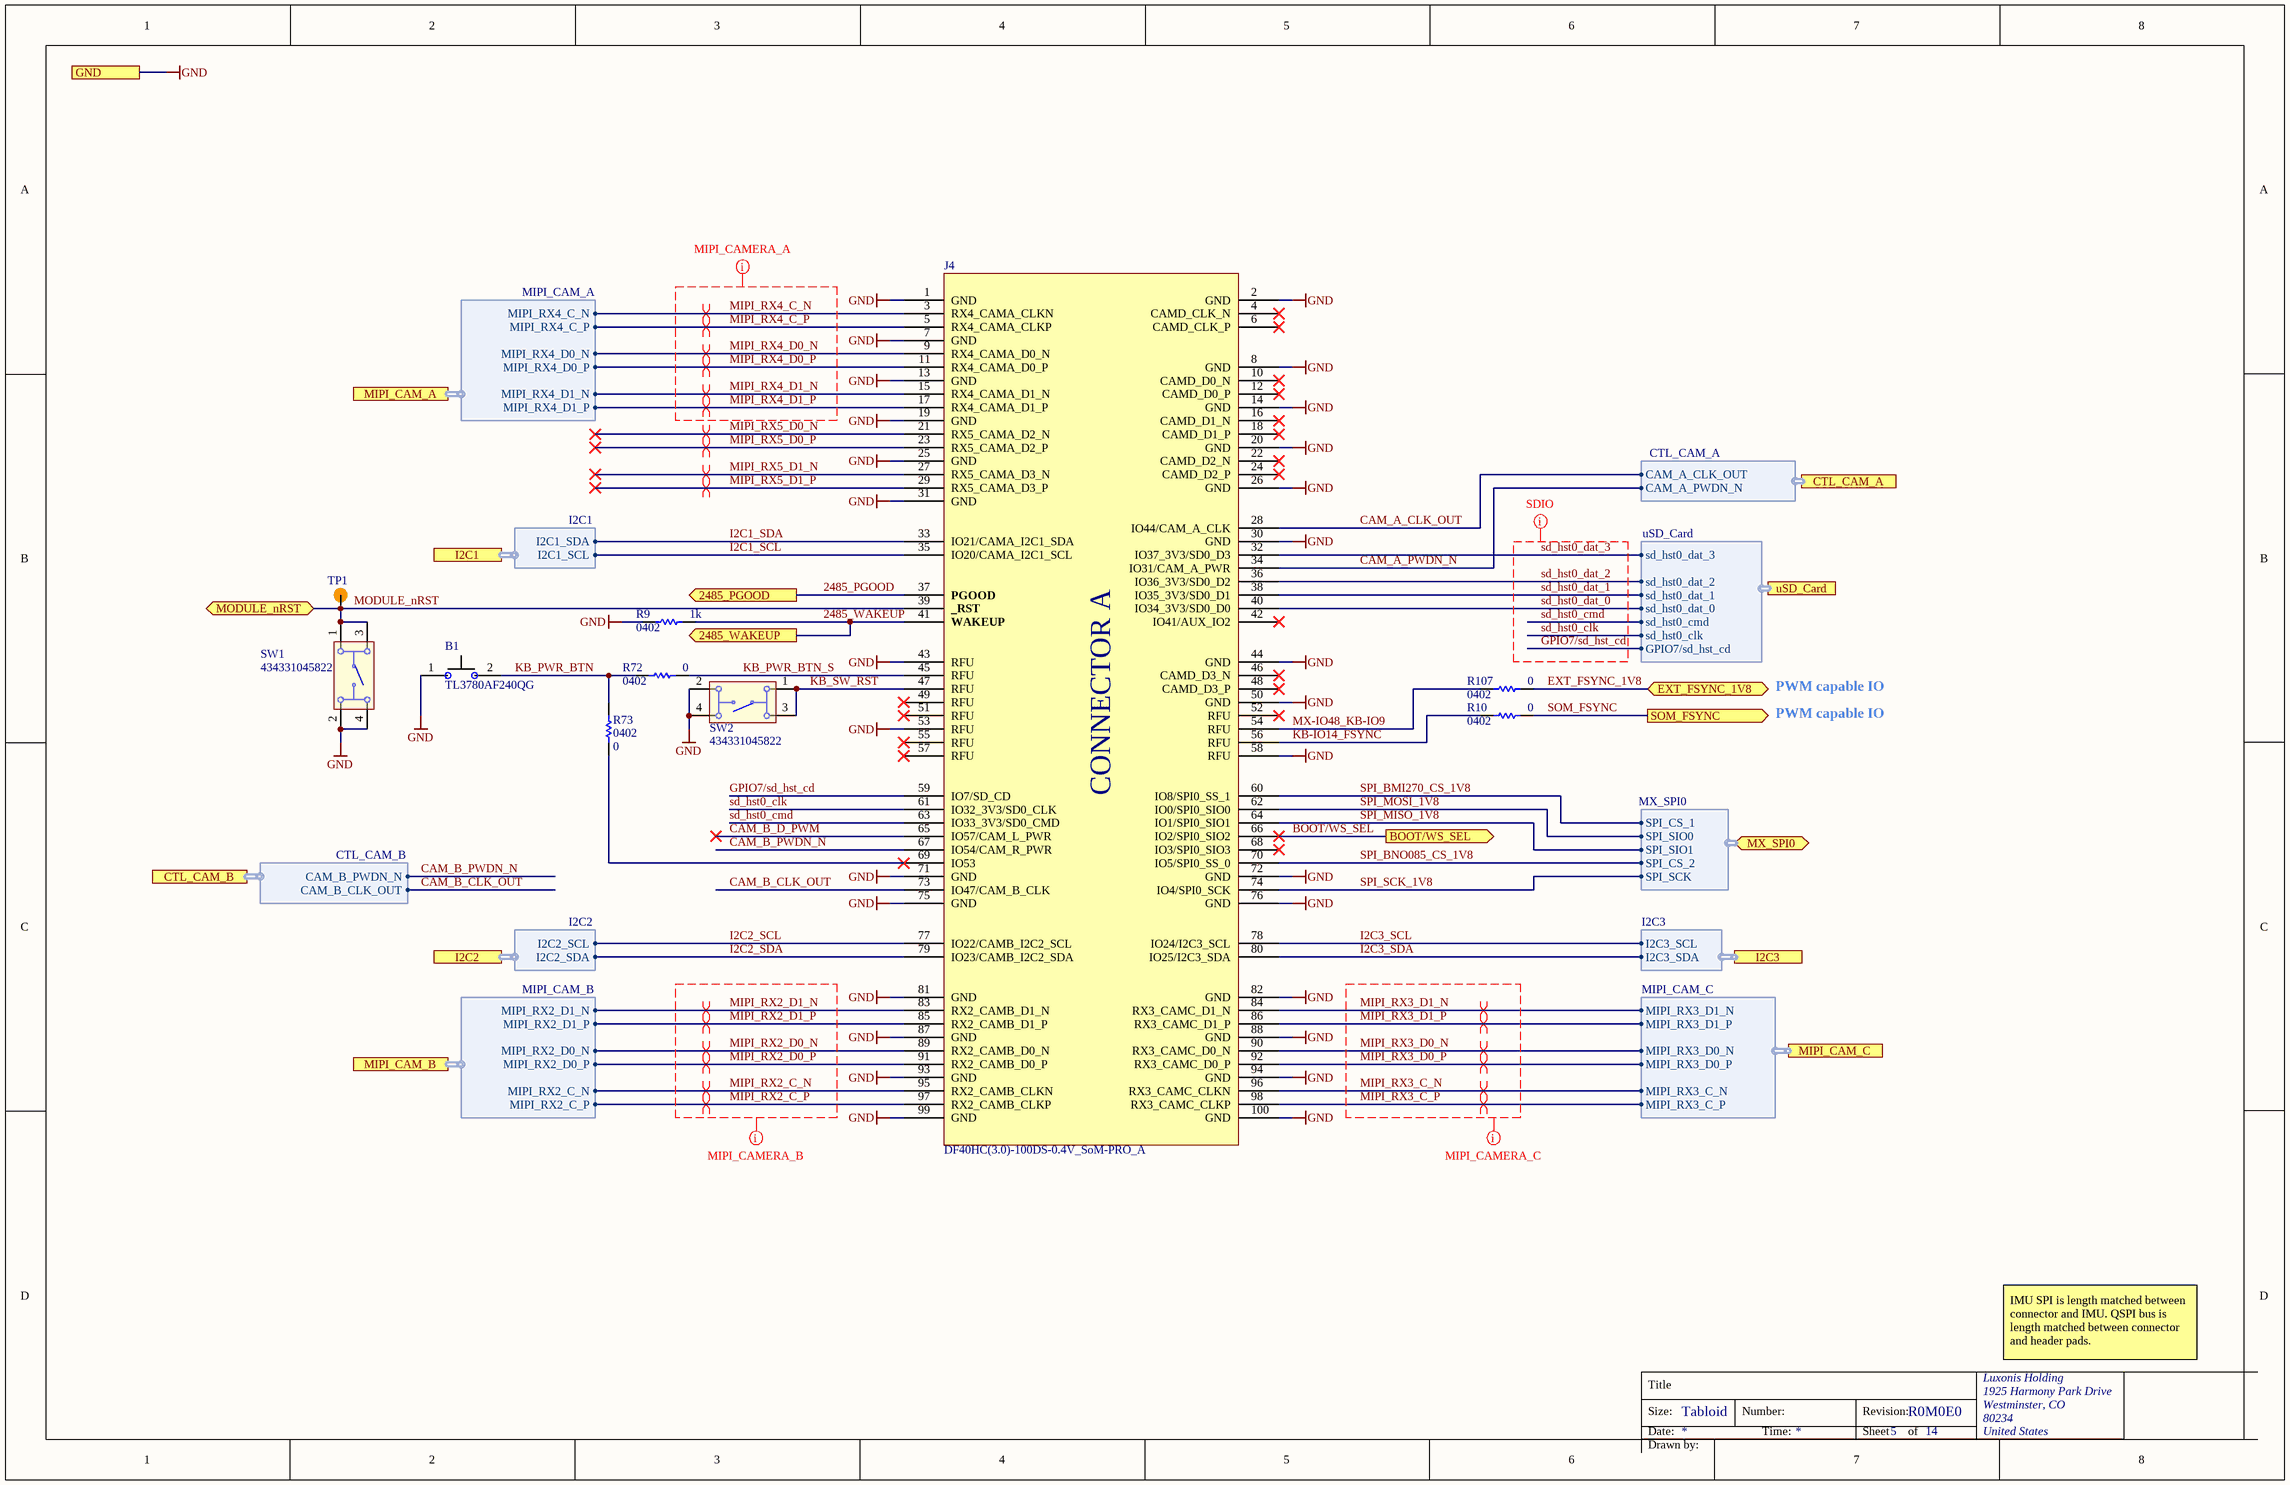
[diagram p3: CONNECTOR_A.SchDoc]

### Parts
B1  TL3780AF240QG  [TL3780AF240QG-Footprint-1]
J4  DF40HC(3.0)-100DS-0.4V_SoM-PRO_A  [CON_A_BW2099_SoM_DF40HC-3.0-100DS-0.4V_minpad]
R9  value 1k  Case/Package: 0402  [RESC0402(1005)_L]  (hidden comment: RC0402FR-071KL)
R10  value 0  Case/Package: 0402  [RESC0402(1005)_L]  (hidden comment: CRCW04020000Z0ED)
R72  value 0  Case/Package: 0402  [RESC0402(1005)_L]  (hidden comment: CRCW04020000Z0ED)
R73  value 0  Case/Package: 0402  [RESC0402(1005)_L]  (hidden comment: CRCW04020000Z0ED)
R107  value 0  Case/Package: 0402  [RESC0402(1005)_L]  (hidden comment: CRCW04020000Z0ED)
SW1  434331045822  [434331045822]
SW2  434331045822  [434331045822]
TP1  TP075_150_NS  [TP075_150_NS]  (value not drawn)  (no BOM)

### Ports
2485_PGOOD (out), 2485_WAKEUP (out), BOOT/WS_SEL (out), CTL_CAM_A (harness CTL_CAM_A), CTL_CAM_B (harness CTL_CAM_B), EXT_FSYNC_1V8 (bidir), GND, I2C1 (harness I2C1), I2C2 (harness I2C2), I2C3 (harness I2C3), MIPI_CAM_A (harness MIPI_CAM_A), MIPI_CAM_B (harness MIPI_CAM_B), MIPI_CAM_C (harness MIPI_CAM_C), MODULE_nRST (bidir), MX_SPI0 (bidir, harness MX_SPI0), SOM_FSYNC (out), uSD_Card (harness uSD_Card)

### Harnesses
MIPI_CAM_B: MIPI_RX2_C_P, MIPI_RX2_C_N, MIPI_RX2_D0_P, MIPI_RX2_D0_N, MIPI_RX2_D1_P, MIPI_RX2_D1_N
MIPI_CAM_A: MIPI_RX4_C_N, MIPI_RX4_C_P, MIPI_RX4_D0_N, MIPI_RX4_D0_P, MIPI_RX4_D1_N, MIPI_RX4_D1_P
MIPI_CAM_C: MIPI_RX3_C_P, MIPI_RX3_C_N, MIPI_RX3_D0_P, MIPI_RX3_D0_N, MIPI_RX3_D1_P, MIPI_RX3_D1_N
I2C2: I2C2_SDA, I2C2_SCL
I2C1: I2C1_SDA, I2C1_SCL
I2C3: I2C3_SDA, I2C3_SCL
MX_SPI0: SPI_SIO0, SPI_SIO1, SPI_CS_1, SPI_SCK, SPI_CS_2
CTL_CAM_A: CAM_A_PWDN_N, CAM_A_CLK_OUT
uSD_Card: sd_hst0_clk, sd_hst0_cmd, sd_hst0_dat_0, sd_hst0_dat_1, sd_hst0_dat_2, sd_hst0_dat_3, GPIO7/sd_hst_cd
CTL_CAM_B: CAM_B_PWDN_N, CAM_B_CLK_OUT

### Nets
GND: B1.1 J4.1(GND) J4.2(GND) J4.7(GND) J4.8(GND) J4.13(GND) J4.14(GND) J4.19(GND) J4.20(GND) J4.25(GND) J4.26(GND) J4.30(GND) J4.31(GND) J4.43(RFU) J4.44(GND) J4.50(GND) J4.53(RFU) J4.58(RFU) J4.71(GND) J4.72(GND) J4.75(GND) J4.76(GND) J4.81(GND) J4.82(GND) J4.87(GND) J4.88(GND) J4.93(GND) J4.94(GND) J4.99(GND) J4.100(GND) R9.2 SW1.2 SW1.4 SW2.2 SW2.4 ; port GND
2485_PGOOD: J4.37(PGOOD) ; port 2485_PGOOD
2485_WAKEUP: J4.41(WAKEUP) R9.1 ; port 2485_WAKEUP
BOOT/WS_SEL: J4.66(IO2/SPI0_SIO2) ; port BOOT/WS_SEL
CAM_A_CLK_OUT: J4.28(IO44/CAM_A_CLK) ; port CTL_CAM_A.CAM_A_CLK_OUT
CAM_A_PWDN_N: J4.34(IO31/CAM_A_PWR) ; port CTL_CAM_A.CAM_A_PWDN_N
CAM_B_CLK_OUT: J4.73(IO47/CAM_B_CLK) ; port CTL_CAM_B.CAM_B_CLK_OUT
CAM_B_D_PWM: J4.65(IO57/CAM_L_PWR)
CAM_B_PWDN_N: J4.67(IO54/CAM_R_PWR) ; port CTL_CAM_B.CAM_B_PWDN_N
EXT_FSYNC_1V8: R107.2 ; port EXT_FSYNC_1V8
GPIO7/sd_hst_cd: J4.59(IO7/SD_CD) ; port uSD_Card.GPIO7/sd_hst_cd
I2C1_SCL: J4.35(IO20/CAMA_I2C1_SCL) ; port I2C1.I2C1_SCL
I2C1_SDA: J4.33(IO21/CAMA_I2C1_SDA) ; port I2C1.I2C1_SDA
I2C2_SCL: J4.77(IO22/CAMB_I2C2_SCL) ; port I2C2.I2C2_SCL
I2C2_SDA: J4.79(IO23/CAMB_I2C2_SDA) ; port I2C2.I2C2_SDA
I2C3_SCL: J4.78(IO24/I2C3_SCL) ; port I2C3.I2C3_SCL
I2C3_SDA: J4.80(IO25/I2C3_SDA) ; port I2C3.I2C3_SDA
KB-IO14_FSYNC: J4.56(RFU) R10.1
KB_PWR_BTN: B1.2 R72.1 R73.2
KB_PWR_BTN_S: J4.45(RFU) R72.2
KB_SW_RST: J4.47(RFU) SW2.1 SW2.3
MIPI_RX2_C_N: J4.95(RX2_CAMB_CLKN) ; port MIPI_CAM_B.MIPI_RX2_C_N
MIPI_RX2_C_P: J4.97(RX2_CAMB_CLKP) ; port MIPI_CAM_B.MIPI_RX2_C_P
MIPI_RX2_D0_N: J4.89(RX2_CAMB_D0_N) ; port MIPI_CAM_B.MIPI_RX2_D0_N
MIPI_RX2_D0_P: J4.91(RX2_CAMB_D0_P) ; port MIPI_CAM_B.MIPI_RX2_D0_P
MIPI_RX2_D1_N: J4.83(RX2_CAMB_D1_N) ; port MIPI_CAM_B.MIPI_RX2_D1_N
MIPI_RX2_D1_P: J4.85(RX2_CAMB_D1_P) ; port MIPI_CAM_B.MIPI_RX2_D1_P
MIPI_RX3_C_N: J4.96(RX3_CAMC_CLKN) ; port MIPI_CAM_C.MIPI_RX3_C_N
MIPI_RX3_C_P: J4.98(RX3_CAMC_CLKP) ; port MIPI_CAM_C.MIPI_RX3_C_P
MIPI_RX3_D0_N: J4.90(RX3_CAMC_D0_N) ; port MIPI_CAM_C.MIPI_RX3_D0_N
MIPI_RX3_D0_P: J4.92(RX3_CAMC_D0_P) ; port MIPI_CAM_C.MIPI_RX3_D0_P
MIPI_RX3_D1_N: J4.84(RX3_CAMC_D1_N) ; port MIPI_CAM_C.MIPI_RX3_D1_N
MIPI_RX3_D1_P: J4.86(RX3_CAMC_D1_P) ; port MIPI_CAM_C.MIPI_RX3_D1_P
MIPI_RX4_C_N: J4.3(RX4_CAMA_CLKN) ; port MIPI_CAM_A.MIPI_RX4_C_N
MIPI_RX4_C_P: J4.5(RX4_CAMA_CLKP) ; port MIPI_CAM_A.MIPI_RX4_C_P
MIPI_RX4_D0_N: J4.9(RX4_CAMA_D0_N) ; port MIPI_CAM_A.MIPI_RX4_D0_N
MIPI_RX4_D0_P: J4.11(RX4_CAMA_D0_P) ; port MIPI_CAM_A.MIPI_RX4_D0_P
MIPI_RX4_D1_N: J4.15(RX4_CAMA_D1_N) ; port MIPI_CAM_A.MIPI_RX4_D1_N
MIPI_RX4_D1_P: J4.17(RX4_CAMA_D1_P) ; port MIPI_CAM_A.MIPI_RX4_D1_P
MIPI_RX5_D0_N: J4.21(RX5_CAMA_D2_N)
MIPI_RX5_D0_P: J4.23(RX5_CAMA_D2_P)
MIPI_RX5_D1_N: J4.27(RX5_CAMA_D3_N)
MIPI_RX5_D1_P: J4.29(RX5_CAMA_D3_P)
MODULE_nRST: J4.39(_RST) SW1.1 SW1.3 TP1.1 ; port MODULE_nRST
MX-IO48_KB-IO9: J4.54(RFU) R107.1
sd_hst0_clk: J4.61(IO32_3V3/SD0_CLK) ; port uSD_Card.sd_hst0_clk
sd_hst0_cmd: J4.63(IO33_3V3/SD0_CMD) ; port uSD_Card.sd_hst0_cmd
sd_hst0_dat_0: J4.40(IO34_3V3/SD0_D0) ; port uSD_Card.sd_hst0_dat_0
sd_hst0_dat_1: J4.38(IO35_3V3/SD0_D1) ; port uSD_Card.sd_hst0_dat_1
sd_hst0_dat_2: J4.36(IO36_3V3/SD0_D2) ; port uSD_Card.sd_hst0_dat_2
sd_hst0_dat_3: J4.32(IO37_3V3/SD0_D3) ; port uSD_Card.sd_hst0_dat_3
SOM_FSYNC: R10.2 ; port SOM_FSYNC
SPI_BMI270_CS_1V8: J4.60(IO8/SPI0_SS_1) ; port MX_SPI0.SPI_CS_1
SPI_BNO085_CS_1V8: J4.70(IO5/SPI0_SS_0) ; port MX_SPI0.SPI_CS_2
SPI_MISO_1V8: J4.64(IO1/SPI0_SIO1) ; port MX_SPI0.SPI_SIO1
SPI_MOSI_1V8: J4.62(IO0/SPI0_SIO0) ; port MX_SPI0.SPI_SIO0
SPI_SCK_1V8: J4.74(IO4/SPI0_SCK) ; port MX_SPI0.SPI_SCK
NetJ4_69: J4.69(IO53) R73.1

Not connected (* = marked no-connect by the designer): J4 4(CAMD_CLK_N)* 6(CAMD_CLK_P)* 10(CAMD_D0_N)* 12(CAMD_D0_P)* 16(CAMD_D1_N)* 18(CAMD_D1_P)* 22(CAMD_D2_N)* 24(CAMD_D2_P)* 42(IO41/AUX_IO2)* 46(CAMD_D3_N)* 48(CAMD_D3_P)* 49(RFU)* 51(RFU)* 52(RFU)* 55(RFU)* 57(RFU)* 68(IO3/SPI0_SIO3)*

### Layout directives
net class MIPI_CAM_A: MIPI_RX4_C_N, MIPI_RX4_C_P, MIPI_RX4_D0_N, MIPI_RX4_D0_P, MIPI_RX4_D1_N, MIPI_RX4_D1_P
net class MIPI_CAM_C: MIPI_RX3_C_N, MIPI_RX3_C_P, MIPI_RX3_D0_N, MIPI_RX3_D0_P, MIPI_RX3_D1_N, MIPI_RX3_D1_P
net class MIPI_CAM_B: MIPI_RX2_C_N, MIPI_RX2_C_P, MIPI_RX2_D0_N, MIPI_RX2_D0_P, MIPI_RX2_D1_N, MIPI_RX2_D1_P
net class SDIO: GPIO7/sd_hst_cd, sd_hst0_clk, sd_hst0_cmd, sd_hst0_dat_0, sd_hst0_dat_1, sd_hst0_dat_2, sd_hst0_dat_3
differential pair; net class MIPI; differential pair class 100ohm: MIPI_RX2_C_N, MIPI_RX2_C_P, MIPI_RX2_D0_N, MIPI_RX2_D0_P, MIPI_RX2_D1_N, MIPI_RX2_D1_P, MIPI_RX3_C_N, MIPI_RX3_C_P, MIPI_RX3_D0_N, MIPI_RX3_D0_P, MIPI_RX3_D1_N, MIPI_RX3_D1_P, MIPI_RX4_C_N, MIPI_RX4_C_P, MIPI_RX4_D0_N, MIPI_RX4_D0_P, MIPI_RX4_D1_N, MIPI_RX4_D1_P, MIPI_RX5_D0_N, MIPI_RX5_D0_P, MIPI_RX5_D1_N, MIPI_RX5_D1_P

### Notes on the sheet
- PWM capable IO
- IMU SPI is length matched between connector and IMU. QSPI bus is length matched between connector and header pads.
- Title
- Size:
- Date:
- Tabloid
- Number:
- Time:
- Revision:
- Sheet
- of
- Drawn by:
- (in symbol CMP-005-000052-4) CONNECTOR A

### Library data of the parts
B1 = CMP-011-00023-1: Keypad Switch, 1 Switches, SPST, Momentary-tactile, 0.05A, 12VDC, 2.35N, Solder Terminal, Surface Mount-straight; Manufacturer 1: E-Switch; Manufacturer Part Number 1: TL3780AF240QG
J4 = CMP-005-000052-4: OAK-SoM-Pro base board conn. A; Manufacturer Part Number 1: DF40HC(3.0)-100DS-0.4V(58); Manufacturer 1: Hirose; Pitch: 0.016inch; Number of Positions: 100; System: Connector; Connector Type: Receptacle; Contact Plating: Gold; Pricing 1: 1=2.54000, 10=2.26000, 25=2.07000, 50=2.07000, 100=1.98000, 250=1.79000, 500=1.65000, 1000=1.41000, 3000=1.32000, 6000=1.23000, 10000=1.23000 (USD); Pricing 2: 1=2.50000, 10=2.40000, 25=2.10000, 50=2.10000, 100=2.00000, 250=1.76000, 500=1.71000, 1000=1.45000, 2000=1.36000, 5000=1.31000, 10000=1.31000 (USD); ComponentLink2URL: https://datasheet.ciiva.com/18562/ed-df40-20140305-18562189.pdf?src-supplier=Digi-Key; ComponentLink3URL: https://datasheet.ciiva.com/13559/ed-df40-20140305-13559540.pdf?src-supplier=Mouser; ComponentLink4URL: https://datasheet.ciiva.com/18562/ed-df40-20140305-18562462.pdf?src-supplier=Digi-Key; Number of Rows: 2; Mount: Surface Mount; Packaging: Tape and Reel; Package Quantity: 1000; Design Item ID: DF40HC(3.0)-100DS-0.4V_SoM-PRO_A; ComponentLink1URL: https://datasheet.ciiva.com/46636/ed-df40-20140305-46636517.pdf?src-supplier=Digi-Key; ComponentLink2Description: https://datasheet.ciiva.com/18562/ed-df40-20140305-18562189.pdf?src-supplier=Digi-Key; RoHS: Yes; Source: LuxonisMaster.SchLib; Lead Free: Lead Free; Stock 1: 2172; Stock 2: 2078; ComponentLink3Description: https://datasheet.ciiva.com/13559/ed-df40-20140305-13559540.pdf?src-supplier=Mouser; ComponentLink1Description: https://datasheet.ciiva.com/46636/ed-df40-20140305-46636517.pdf?src-supplier=Digi-Key; ComponentLink4Description: https://datasheet.ciiva.com/18562/ed-df40-20140305-18562462.pdf?src-supplier=Digi-Key; Pins: 100
R9 = CMP-013-000004-10: RES SMD 1K OHM 1% 1/16W 0402; Manufacturer 1: Yageo; Power Rating: 62.5mW; Voltage Rating: 50V; Min Operating Temperature: -55°C; Design Item ID: RC0402FR-071KL; Tolerance: 1%; Max Operating Temperature: 155°C; Manufacturer Part Number 1: RC0402FR-071KL
R10 R72 R73 R107 = CMP-013-000022-11: as R17 on sheet CONNECTOR_B; Max Operating Temperature: 155°C; Manufacturer Part Number 1: CRCW04020000Z0ED; Tolerance: 5%; Min Operating Temperature: -55°C; Design Item ID: CRCW04020000Z0ED
SW1 SW2 = CMP-011-00016-3: as SW3 on sheet CONNECTOR_B; Supplier Part Number 1: 732-7055-2-ND; Manufacturer part number 1: 434331045822; Pins: 4; Supplier 1: Digi-Key; Current Rating: 50mA; Mounting Technology: SMD; Case/Package: 434331045822
TP1 = TEST_POINT

## Sheet ETH_PCIE_CTRL.SchDoc: =project_title
size Tabloid; CompanyName: Luxonis Holding; DrawnBy: Eason Lin; Organization: Luxonis Holding; Address1: 1925 Harmony Park Drive; Address2: Westminster, CO; Address3: 80234; Address4: United States; DocumentNumber: D2088000; Revision: R0M0E0; SheetNumber: 14; SheetTotal: 14
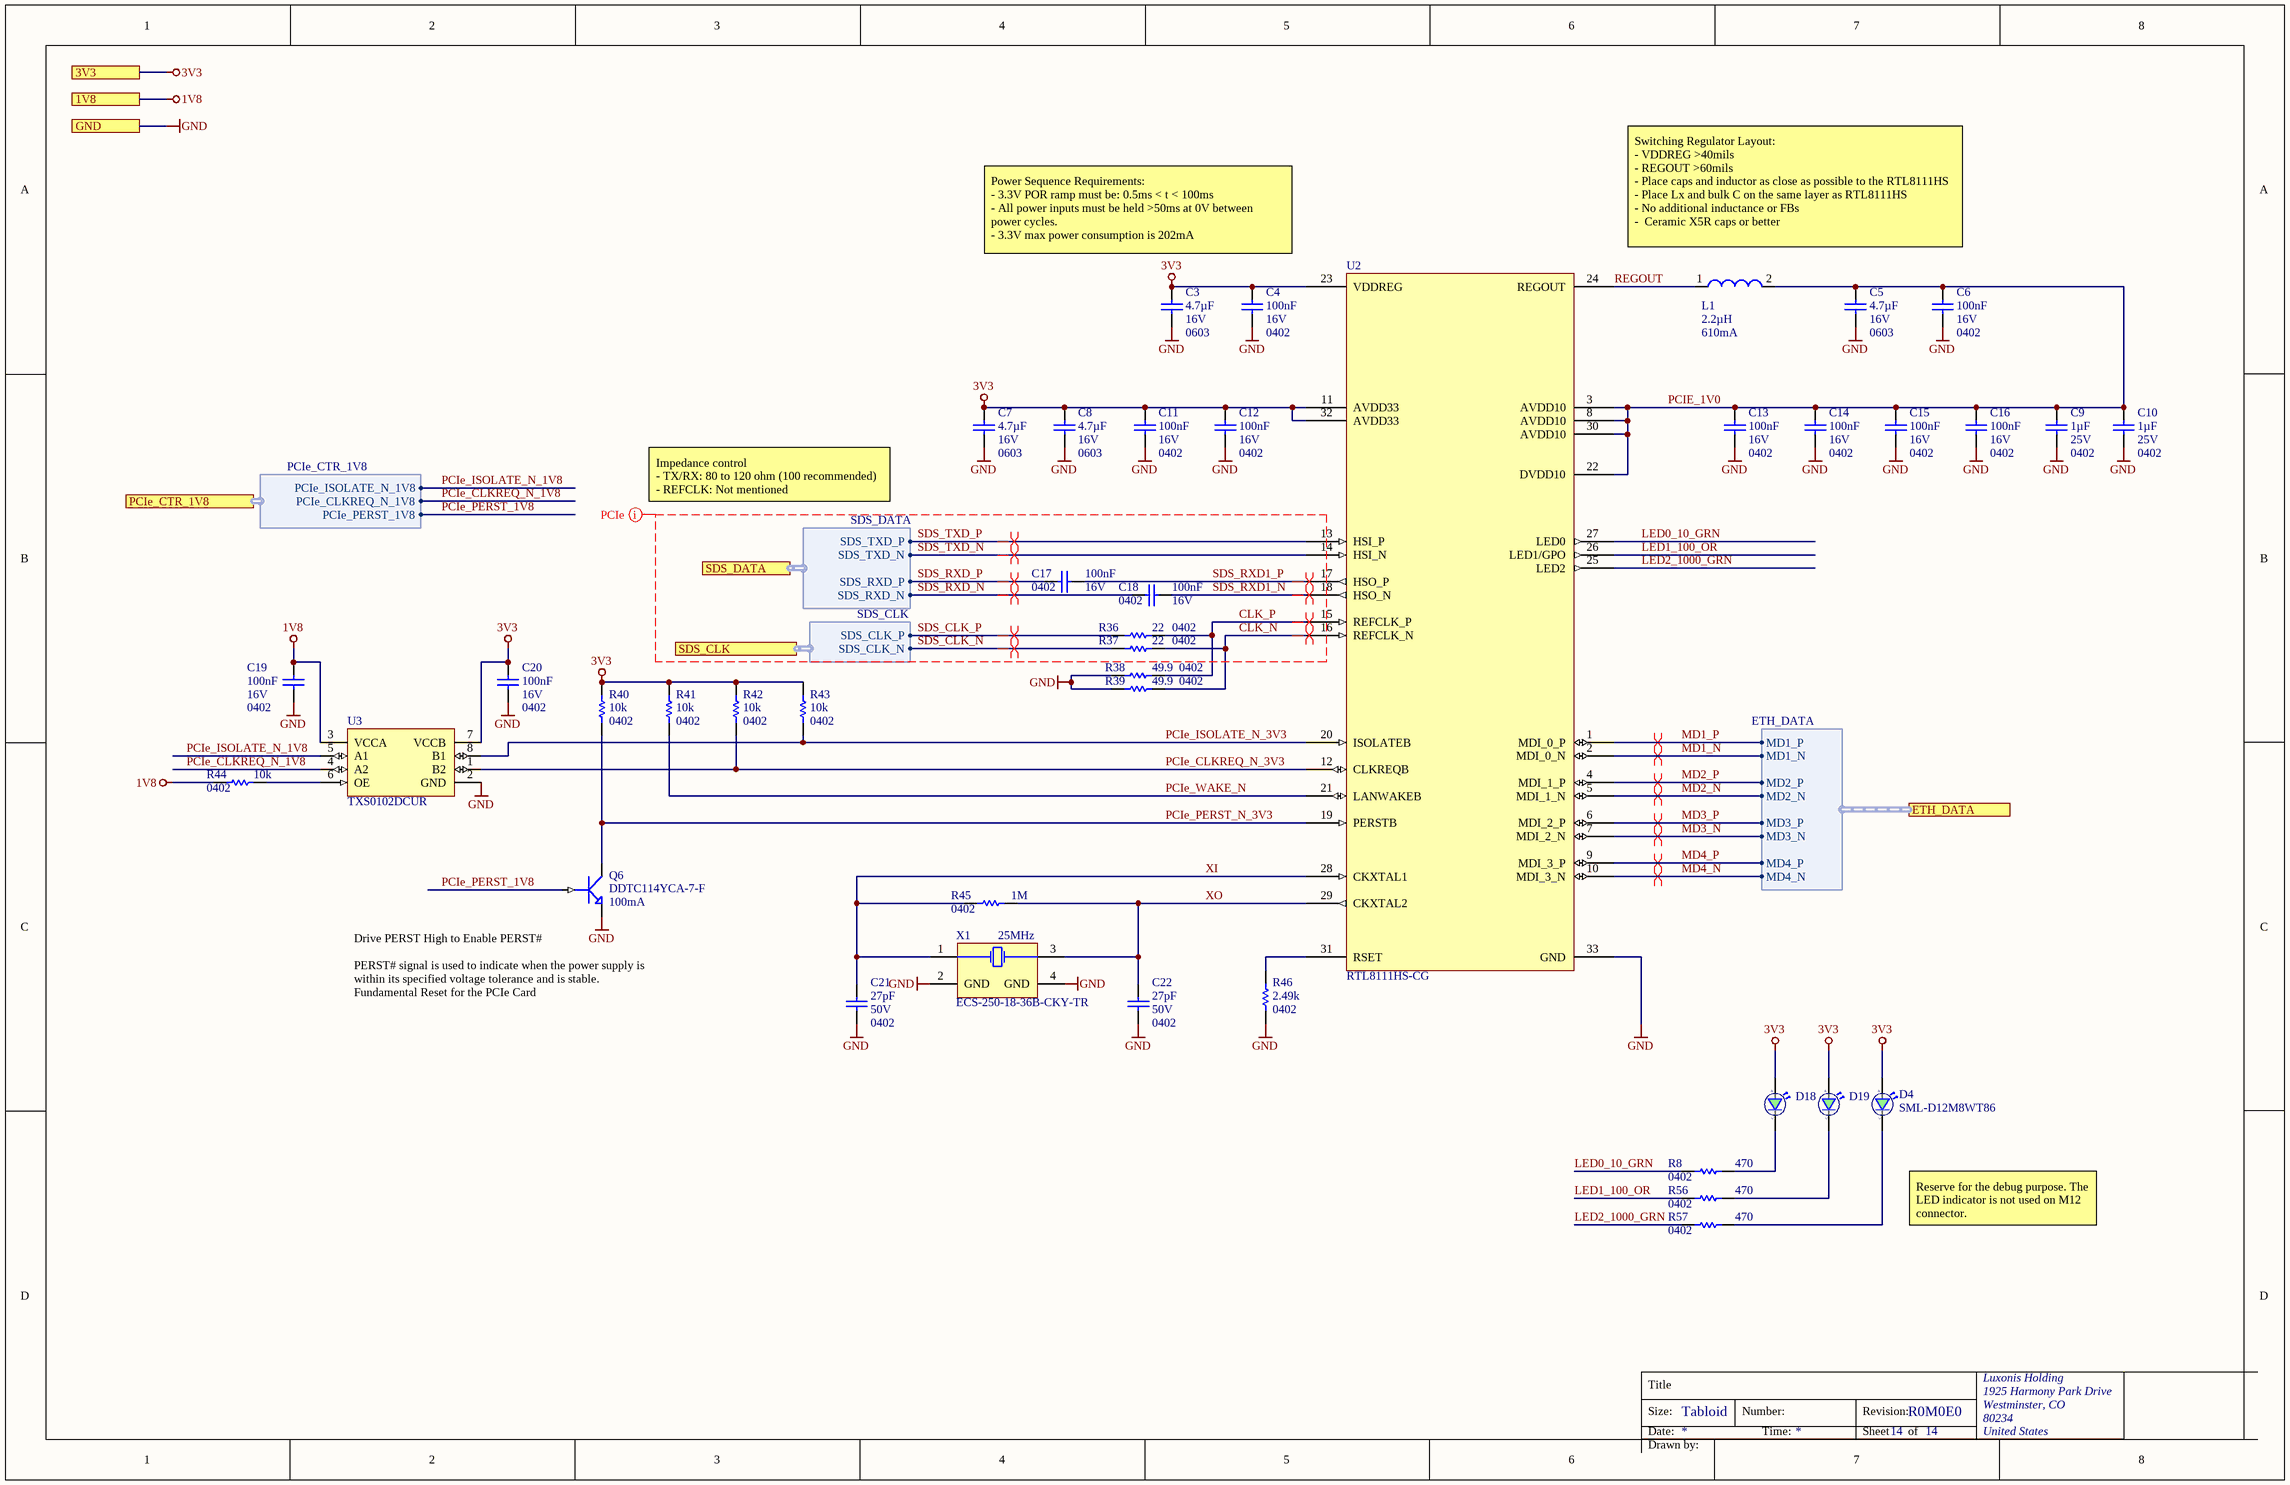
[diagram p4: ETH_PCIE_CTRL.SchDoc]

### Parts
C3  value 4.7µF  Voltage Rating: 16V  Case/Package: 0603  [CAPC0603(1608)100_N]  (hidden comment: GRM188R61C475KAAJD)
C4  value 100nF  Voltage Rating: 16V  Case/Package: 0402  [CAPC0402(1005)60_N]  (hidden comment: CL05B104KO5NFNC)
C5  value 4.7µF  Voltage Rating: 16V  Case/Package: 0603  [CAPC0603(1608)100_N]  (hidden comment: GRM188R61C475KAAJD)
C6  value 100nF  Voltage Rating: 16V  Case/Package: 0402  [CAPC0402(1005)60_N]  (hidden comment: CL05B104KO5NFNC)
C7  value 4.7µF  Voltage Rating: 16V  Case/Package: 0603  [CAPC0603(1608)100_N]  (hidden comment: GRM188R61C475KAAJD)
C8  value 4.7µF  Voltage Rating: 16V  Case/Package: 0603  [CAPC0603(1608)100_N]  (hidden comment: GRM188R61C475KAAJD)
C9  value 1µF  Voltage Rating: 25V  Case/Package: 0402  [CAPC0402(1005)70_N]  (hidden comment: GRM155R61E105KA12D)
C10  value 1µF  Voltage Rating: 25V  Case/Package: 0402  [CAPC0402(1005)70_N]  (hidden comment: GRM155R61E105KA12D)
C11  value 100nF  Voltage Rating: 16V  Case/Package: 0402  [CAPC0402(1005)60_N]  (hidden comment: CL05B104KO5NFNC)
C12  value 100nF  Voltage Rating: 16V  Case/Package: 0402  [CAPC0402(1005)60_N]  (hidden comment: CL05B104KO5NFNC)
C13  value 100nF  Voltage Rating: 16V  Case/Package: 0402  [CAPC0402(1005)60_N]  (hidden comment: CL05B104KO5NFNC)
C14  value 100nF  Voltage Rating: 16V  Case/Package: 0402  [CAPC0402(1005)60_N]  (hidden comment: CL05B104KO5NFNC)
C15  value 100nF  Voltage Rating: 16V  Case/Package: 0402  [CAPC0402(1005)60_N]  (hidden comment: CL05B104KO5NFNC)
C16  value 100nF  Voltage Rating: 16V  Case/Package: 0402  [CAPC0402(1005)60_N]  (hidden comment: CL05B104KO5NFNC)
C17  value 100nF  Voltage Rating: 16V  Case/Package: 0402  [CAPC0402(1005)60_N]  (hidden comment: CL05B104KO5NFNC)
C18  value 100nF  Voltage Rating: 16V  Case/Package: 0402  [CAPC0402(1005)60_N]  (hidden comment: CL05B104KO5NFNC)
C19  value 100nF  Voltage Rating: 16V  Case/Package: 0402  [CAPC0402(1005)60_N]  (hidden comment: CL05B104KO5NFNC)
C20  value 100nF  Voltage Rating: 16V  Case/Package: 0402  [CAPC0402(1005)60_N]  (hidden comment: CL05B104KO5NFNC)
C21  value 27pF  Voltage Rating: 50V  Case/Package: 0402  [CAPC0402(1005)60_N]  (hidden comment: C0402C270J5GACTU)
C22  value 27pF  Voltage Rating: 50V  Case/Package: 0402  [CAPC0402(1005)60_N]  (hidden comment: C0402C270J5GACTU)
D4  SML-D12M8WT86  [SML_D1xx8W]
D18  SML-D12M8WT86  [SML_D1xx8W]  (value not drawn)
D19  SML-D12M8WT86  [SML_D1xx8W]  (value not drawn)
L1  value 2.2µH  Current Rating: 610mA  [LQH32NH2R2J23L]  (hidden comment: LQH32NH2R2J23L)
Q6  DDTC114YCA-7-F  Continuous Drain Current: 100mA  [DDTC114YCA-7-F-Footprint-1]
R8  value 470  Case/Package: 0402  [RESC0402(1005)_L]  (hidden comment: CRCW0402470RFKED)
R36  value 22  Case/Package: 0402  [RESC0402(1005)_N]  (hidden comment: RC0402FR-0722RL)
R37  value 22  Case/Package: 0402  [RESC0402(1005)_N]  (hidden comment: RC0402FR-0722RL)
R38  value 49.9  Case/Package: 0402  [RESC0402(1005)_L]  (hidden comment: RC0402FR-0749R9L)
R39  value 49.9  Case/Package: 0402  [RESC0402(1005)_L]  (hidden comment: RC0402FR-0749R9L)
R40  value 10k  Case/Package: 0402  [RESC0402(1005)_N]  (hidden comment: RC0402FR-1310KL)
R41  value 10k  Case/Package: 0402  [RESC0402(1005)_N]  (hidden comment: RC0402FR-1310KL)
R42  value 10k  Case/Package: 0402  [RESC0402(1005)_N]  (hidden comment: RC0402FR-1310KL)
R43  value 10k  Case/Package: 0402  [RESC0402(1005)_N]  (hidden comment: RC0402FR-1310KL)
R44  value 10k  Case/Package: 0402  [RESC0402(1005)_N]  (hidden comment: RC0402FR-1310KL)
R45  value 1M  Case/Package: 0402  [RESC0402(1005)_L]  (hidden comment: RC0402FR-071ML)
R46  value 2.49k  Case/Package: 0402  [RESC0402(1005)_N]  (hidden comment: RC0402FR-072K49L)
R56  value 470  Case/Package: 0402  [RESC0402(1005)_L]  (hidden comment: CRCW0402470RFKED)
R57  value 470  Case/Package: 0402  [RESC0402(1005)_L]  (hidden comment: CRCW0402470RFKED)
U2  RTL8111HS-CG  [RTL8111Hx-CG]
U3  TXS0102DCUR  [TXS0102DCUR]
X1  ECS-250-18-36B-CKY-TR  Frequency: 25MHz  [ECS-250-18-36B-CKY-TR]

### Ports
1V8, 3V3, ETH_DATA (harness ETH_DATA), GND, PCIe_CTR_1V8 (harness PCIe_CTR_1V8), SDS_CLK (harness SDS_CLK), SDS_DATA (harness SDS_DATA)

### Harnesses
ETH_DATA: MD1_P, MD1_N, MD2_P, MD2_N, MD3_P, MD3_N, MD4_P, MD4_N
SDS_DATA: SDS_TXD_P, SDS_TXD_N, SDS_RXD_P, SDS_RXD_N
SDS_CLK: SDS_CLK_P, SDS_CLK_N
PCIe_CTR_1V8: PCIe_CLKREQ_N_1V8, PCIe_ISOLATE_N_1V8, PCIe_PERST_1V8

### Nets
1V8: C19.2 R44.1 U3.3(VCCA) ; port 1V8
3V3: C3.2 C4.2 C7.2 C8.2 C11.2 C12.2 C20.2 D4.2(A) D18.2(A) D19.2(A) R40.2 R41.2 R42.2 R43.2 U2.11(AVDD33) U2.23(VDDREG) U2.32(AVDD33) U3.7(VCCB) ; port 3V3
GND: C3.1 C4.1 C5.1 C6.1 C7.1 C8.1 C9.1 C10.1 C11.1 C12.1 C13.1 C14.1 C15.1 C16.1 C19.1 C20.1 C21.1 C22.1 Q6.2(E) R38.1 R39.1 R46.1 U2.33(GND) U3.2(GND) X1.2(GND) X1.4(GND) ; port GND
CLK_N: R37.2 R39.2 U2.16(REFCLK_N)
CLK_P: R36.2 R38.2 U2.15(REFCLK_P)
LED0_10_GRN: R8.1 U2.27(LED0)
LED1_100_OR: R56.1 U2.26(LED1/GPO)
LED2_1000_GRN: R57.1 U2.25(LED2)
MD1_N: U2.2(MDI_0_N) ; port ETH_DATA.MD1_N
MD1_P: U2.1(MDI_0_P) ; port ETH_DATA.MD1_P
MD2_N: U2.5(MDI_1_N) ; port ETH_DATA.MD2_N
MD2_P: U2.4(MDI_1_P) ; port ETH_DATA.MD2_P
MD3_N: U2.7(MDI_2_N) ; port ETH_DATA.MD3_N
MD3_P: U2.6(MDI_2_P) ; port ETH_DATA.MD3_P
MD4_N: U2.10(MDI_3_N) ; port ETH_DATA.MD4_N
MD4_P: U2.9(MDI_3_P) ; port ETH_DATA.MD4_P
PCIE_1V0: C5.2 C6.2 C9.2 C10.2 C13.2 C14.2 C15.2 C16.2 L1.2 U2.3(AVDD10) U2.8(AVDD10) U2.22(DVDD10) U2.30(AVDD10)
PCIe_CLKREQ_N_1V8: U3.4(A2) ; port PCIe_CTR_1V8.PCIe_CLKREQ_N_1V8
PCIe_CLKREQ_N_3V3: R42.1 U2.12(CLKREQB) U3.1(B2)
PCIe_ISOLATE_N_1V8: U3.5(A1) ; port PCIe_CTR_1V8.PCIe_ISOLATE_N_1V8
PCIe_ISOLATE_N_3V3: R43.1 U2.20(ISOLATEB) U3.8(B1)
PCIe_PERST_1V8: Q6.1(B) ; port PCIe_CTR_1V8.PCIe_PERST_1V8
PCIe_PERST_N_3V3: Q6.3(C) R40.1 U2.19(PERSTB)
PCIe_WAKE_N: R41.1 U2.21(LANWAKEB)
REGOUT: L1.1 U2.24(REGOUT)
SDS_CLK_N: R37.1 ; port SDS_CLK.SDS_CLK_N
SDS_CLK_P: R36.1 ; port SDS_CLK.SDS_CLK_P
SDS_RXD1_N: C18.1 U2.18(HSO_N)
SDS_RXD1_P: C17.1 U2.17(HSO_P)
SDS_RXD_N: C18.2 ; port SDS_DATA.SDS_RXD_N
SDS_RXD_P: C17.2 ; port SDS_DATA.SDS_RXD_P
SDS_TXD_N: U2.14(HSI_N) ; port SDS_DATA.SDS_TXD_N
SDS_TXD_P: U2.13(HSI_P) ; port SDS_DATA.SDS_TXD_P
XI: C21.2 R45.1 U2.28(CKXTAL1) X1.1(X1)
XO: C22.2 R45.2 U2.29(CKXTAL2) X1.3(X2)
NetD4_1: D4.1(C) R57.2
NetD18_1: D18.1(C) R8.2
NetD19_1: D19.1(C) R56.2
NetR44_2: R44.2 U3.6(OE)
NetR46_2: R46.2 U2.31(RSET)

### Layout directives
differential pair; net class ETH; differential pair class 100ohm: MD1_N, MD1_P, MD2_N, MD2_P, MD3_N, MD3_P, MD4_N, MD4_P
net class PCIe: CLK_N, CLK_P, SDS_CLK_N, SDS_CLK_P, SDS_RXD1_N, SDS_RXD1_P, SDS_RXD_N, SDS_RXD_P, SDS_TXD_N, SDS_TXD_P
differential pair; net class PCIE; differential pair class 100ohm: CLK_N, CLK_P, SDS_CLK_N, SDS_CLK_P, SDS_RXD1_N, SDS_RXD1_P, SDS_RXD_N, SDS_RXD_P, SDS_TXD_N, SDS_TXD_P

### Notes on the sheet
- Power Sequence Requirements:
  - 3.3V POR ramp must be: 0.5ms < t < 100ms
  - All power inputs must be held >50ms at 0V between power cycles.
  - 3.3V max power consumption is 202mA
- Switching Regulator Layout:
  - VDDREG >40mils
  - REGOUT >60mils
  - Place caps and inductor as close as possible to the RTL8111HS
  - Place Lx and bulk C on the same layer as RTL8111HS
  - No additional inductance or FBs
  -  Ceramic X5R caps or better
- Impedance control
  - TX/RX: 80 to 120 ohm (100 recommended)
  - REFCLK: Not mentioned
  - Confirmed that 100ohm on TX/RX/REFCLK of NG2099
- (near Q6) Drive PERST High to Enable PERST#
- PERST# signal is used to indicate when the power supply is within its specified voltage tolerance and is stable.
  Fundamental Reset for the PCIe Card
- Reserve for the debug purpose. The LED indicator is not used on M12 connector.
- Title
- Size:
- Date:
- Tabloid
- Number:
- Time:
- Revision:
- Sheet
- of
- Drawn by:

### Library data of the parts
C3 C5 C7 C8 = CMP-004-000020-4: CAP CER 4.7UF 16V X5R 0603 10%; Manufacturer 1: Murata; Max Operating Temperature: 85°C; Dielectric: X5R; Design Item ID: GRM188R61C475KAAJD; Depth: 0.8mm; Width: 0.8mm; Manufacturer 2: Murata; Manufacturer Part Number 3: GRM188R61C475KAAJD; Manufacturer Part Number 2: GRM188R61C475KAAJD; ComponentLink1Description: https://datasheet.ciiva.com/14813/595grm188r61c475kaaj23-14813668.pdf?src-supplier=Arrow; ComponentLink1URL: https://datasheet.ciiva.com/14813/595grm188r61c475kaaj23-14813668.pdf?src-supplier=Arrow; Manufacturer Part Number 1: GRM188R61C475KAAJD; Manufacturer 3: Murata; Mounting Technology: SMT; Tolerance: 10%; Length: 1.6mm; Min Operating Temperature: -55°C; Height: 0.8mm
C4 C6 C11-C20 = CMP-108-000002-6: as C38 on sheet CONNECTOR_B; ComponentLink1URL: https://datasheet.ciiva.com/25767/cl05b104ko5nfnc-25767124.pdf?src-supplier=Digi-Key; Length: 1mm; Design Item ID: CL05B104KO5NFNC; Tolerance: 10%; Min Operating Temperature: -55°C; Width: 0.02inch; Dielectric: X7R; ComponentLink1Description: https://datasheet.ciiva.com/25767/cl05b104ko5nfnc-25767124.pdf?src-supplier=Digi-Key; Height: 0.5mm; Depth: 0.5mm; Manufacturer Part Number 1: CL05B104KO5NFNC; Max Operating Temperature: 125°C; Mounting Technology: SMT
C9 C10 = CMP-108-000014-5: CAP CER 1UF 25V X5R 0402 10%; Manufacturer 1: Murata; ComponentLink2Description: https://datasheet.ciiva.com/7719/1666664-7719006.pdf?src-supplier=Element14; ComponentLink2URL: https://datasheet.ciiva.com/7719/1666664-7719006.pdf?src-supplier=Element14; Max Operating Temperature: 85°C; Depth: 0.5mm; Mounting Technology: SMT; ComponentLink1URL: https://datasheet.ciiva.com/22732/1666664-22732122.pdf?src-supplier=Element14; Length: 1mm; ComponentLink1Description: https://datasheet.ciiva.com/22732/1666664-22732122.pdf?src-supplier=Element14; Manufacturer Part Number 1: GRM155R61E105KA12D; Tolerance: 10%; Design Item ID: GRM155R61E105KA12D; Dielectric: X5R; Min Operating Temperature: -55°C; Height: 0.5mm; Width: 0.5mm
C21 C22 = CMP-108-000006-6: CAP CER 27PF 50V C0G 0402 5%; Manufacturer 1: KEMET; Min Operating Temperature: -55°C; Mounting Technology: SMT; Design Item ID: C0402C270J5GACTU; Tolerance: 5%; Max Operating Temperature: 125°C; ComponentLink4Description: https://datasheet.ciiva.com/7392/1372242-7392237.pdf?src-supplier=Newark; Width: 0.5mm; Length: 1mm; ComponentLink1URL: https://datasheet.ciiva.com/144/docfinderpartnumber-c0402c270j5gactu-144118.pdf?src-supplier=Digi-Key; ComponentLink2URL: https://datasheet.ciiva.com/7747/kem-c1003-c0g-smd-7747509.pdf?src-supplier=Element14; ComponentLink4URL: https://datasheet.ciiva.com/7392/1372242-7392237.pdf?src-supplier=Newark; ComponentLink5Description: https://datasheet.ciiva.com/14586/70095383-14586671.pdf?src-supplier=Allied+Electronics; Height: 0.5mm; ComponentLink3Description: https://datasheet.ciiva.com/26847/getdatasheetpartid-408632-26847386.pdf?src-supplier=Verical; Dielectric: C0G; ComponentLink5URL: https://datasheet.ciiva.com/14586/70095383-14586671.pdf?src-supplier=Allied+Electronics; Manufacturer Part Number 1: C0402C270J5GACTU; ComponentLink2Description: https://datasheet.ciiva.com/7747/kem-c1003-c0g-smd-7747509.pdf?src-supplier=Element14; ComponentLink3URL: https://datasheet.ciiva.com/26847/getdatasheetpartid-408632-26847386.pdf?src-supplier=Verical; ComponentLink1Description: https://datasheet.ciiva.com/144/docfinderpartnumber-c0402c270j5gactu-144118.pdf?src-supplier=Digi-Key; Depth: 0.5mm
D4 D18 D19 = CMP-111-000004-2: LED GREEN DIFFUSED 0603 SMD Green 572nm LED Indication - Discrete 2.2V 0603 (1608 Metric); Manufacturer 1: Rohm; Forward Current: 20mA; Color: Green,Yellow; Min Operating Temperature: -40°C; Forward Voltage: 2.2V; Max Operating Temperature: 85°C; Case/Package: 0603; Manufacturer Part Number 1: SML-D12M8WT86
L1 = CMP-112-000003-2: FIXED IND 2.2UH 610MA 97MOHM SMD; Manufacturer 1: Murata; Self Resonant Frequency: 75MHz; Tolerance: 5%; Case/Package: Nonstandard; Manufacturer Part Number 1: LQH32NH2R2J23L
Q6 = CMP-074-000000-3: TRANS PREBIAS NPN 200MW SOT23-3; Manufacturer 1: Diodes; Max Drain to Source Voltage: 50V; Manufacturer Part Number 1: DDTC114YCA-7-F; Case/Package: SOT-23-3; Design Item ID: DDTC114YCA-7-F
R8 R56 R57 = CMP-013-000029-9: RES SMD 470 OHM 1% 1/16W 0402; Manufacturer 1: Vishay; Voltage Rating: 50V; Power Rating: 63mW; Max Operating Temperature: 155°C; Min Operating Temperature: -55°C; Tolerance: 1%; Design Item ID: CRCW0402470RFKED; Manufacturer Part Number 1: CRCW0402470RFKED
R36 R37 = CMP-013-000012-8: RES SMD 22 OHM 1% 1/16W 0402; Manufacturer 1: Yageo; Power Rating: 62.5mW; Min Operating Temperature: -55°C; Tolerance: 1%; Design Item ID: RC0402FR-0722RL; Manufacturer Part Number 1: RC0402FR-0722RL; Max Operating Temperature: 155°C
R38 R39 = CMP-115-000016-6: RES SMD 49.9 OHM 1% 1/16W 0402; Manufacturer 1: Yageo; Temperature Coefficient: 100ppm/°C; Voltage Rating: 50V; Power Rating: 62.5mW; Design Item ID: RC0402FR-0749R9L; Min Operating Temperature: -55°C; Max Operating Temperature: 155°C; Tolerance: 1%; Manufacturer Part Number 1: RC0402FR-0749R9L
R40-R44 = CMP-115-000004-8: as R11 on sheet CONNECTOR_B; Min Operating Temperature: -55°C; Max Operating Temperature: 155°C; Design Item ID: RC0402FR-1310KL; Tolerance: 1%; Manufacturer Part Number 1: RC0402FR-1310KL
R45 = CMP-013-000005-8: RES SMD 1M OHM 1% 1/16W 0402; Manufacturer 1: Yageo; Power Rating: 63mW; Voltage Rating: 50V; Tolerance: 1%; Min Operating Temperature: -55°C; Manufacturer Part Number 1: RC0402FR-071ML; Design Item ID: RC0402FR-071ML; Max Operating Temperature: 155°C
R46 = CMP-115-000015-6: RES SMD 2.49K OHM 1% 1/16W 0402; Manufacturer 1: Yageo; Temperature Coefficient: 100ppm/°C; Power Rating: 62.5mW; Voltage Rating: 50V; Max Operating Temperature: 155°C; Min Operating Temperature: -55°C; Manufacturer Part Number 1: RC0402FR-072K49L; Tolerance: 1%; Design Item ID: RC0402FR-072K49L
U2 = RTL8111HS: IC ETHERNET/PCIe PHY Realtek; Manufacturer 1: Realtek; Manufacturer Part Number 1: RTL8111HS-CG; Supplier 1: Symmetry Electronics; Supplier Part Number 1: RTL8111HS-CG; Supplier 2: Future Electronics; Supplier Part Number 2: RTL8111HS-CG
U3 = CMP-113-000005-2: TEXAS INSTRUMENTS - TXS0102DCUR - IC, TRANSLATOR, 2 BIT, BI, US-8; Max Supply Voltage: 5.5V; Max Output Current: 1A; Min Supply Voltage: 1.65V; Max Operating Temperature: 85°C; Pins: 8; Manufacturer 1: Texas Instruments; Manufacturer Part Number 1: TXS0102DCUR; Case/Package: VSSOP; Min Operating Temperature: -40°C
X1 = CMP-006-000002-2: CRYSTAL 25.0000MHZ 18PF SMD 25MHz ±10ppm Crystal 18pF 50 Ohms 4-SMD, No Lead; Manufacturer 1: ECS International; Manufacturer Part Number 1: ECS-250-18-36B-CKY-TR